# EAGLE design VSCard_v3 (EAGLE 8.3.1)
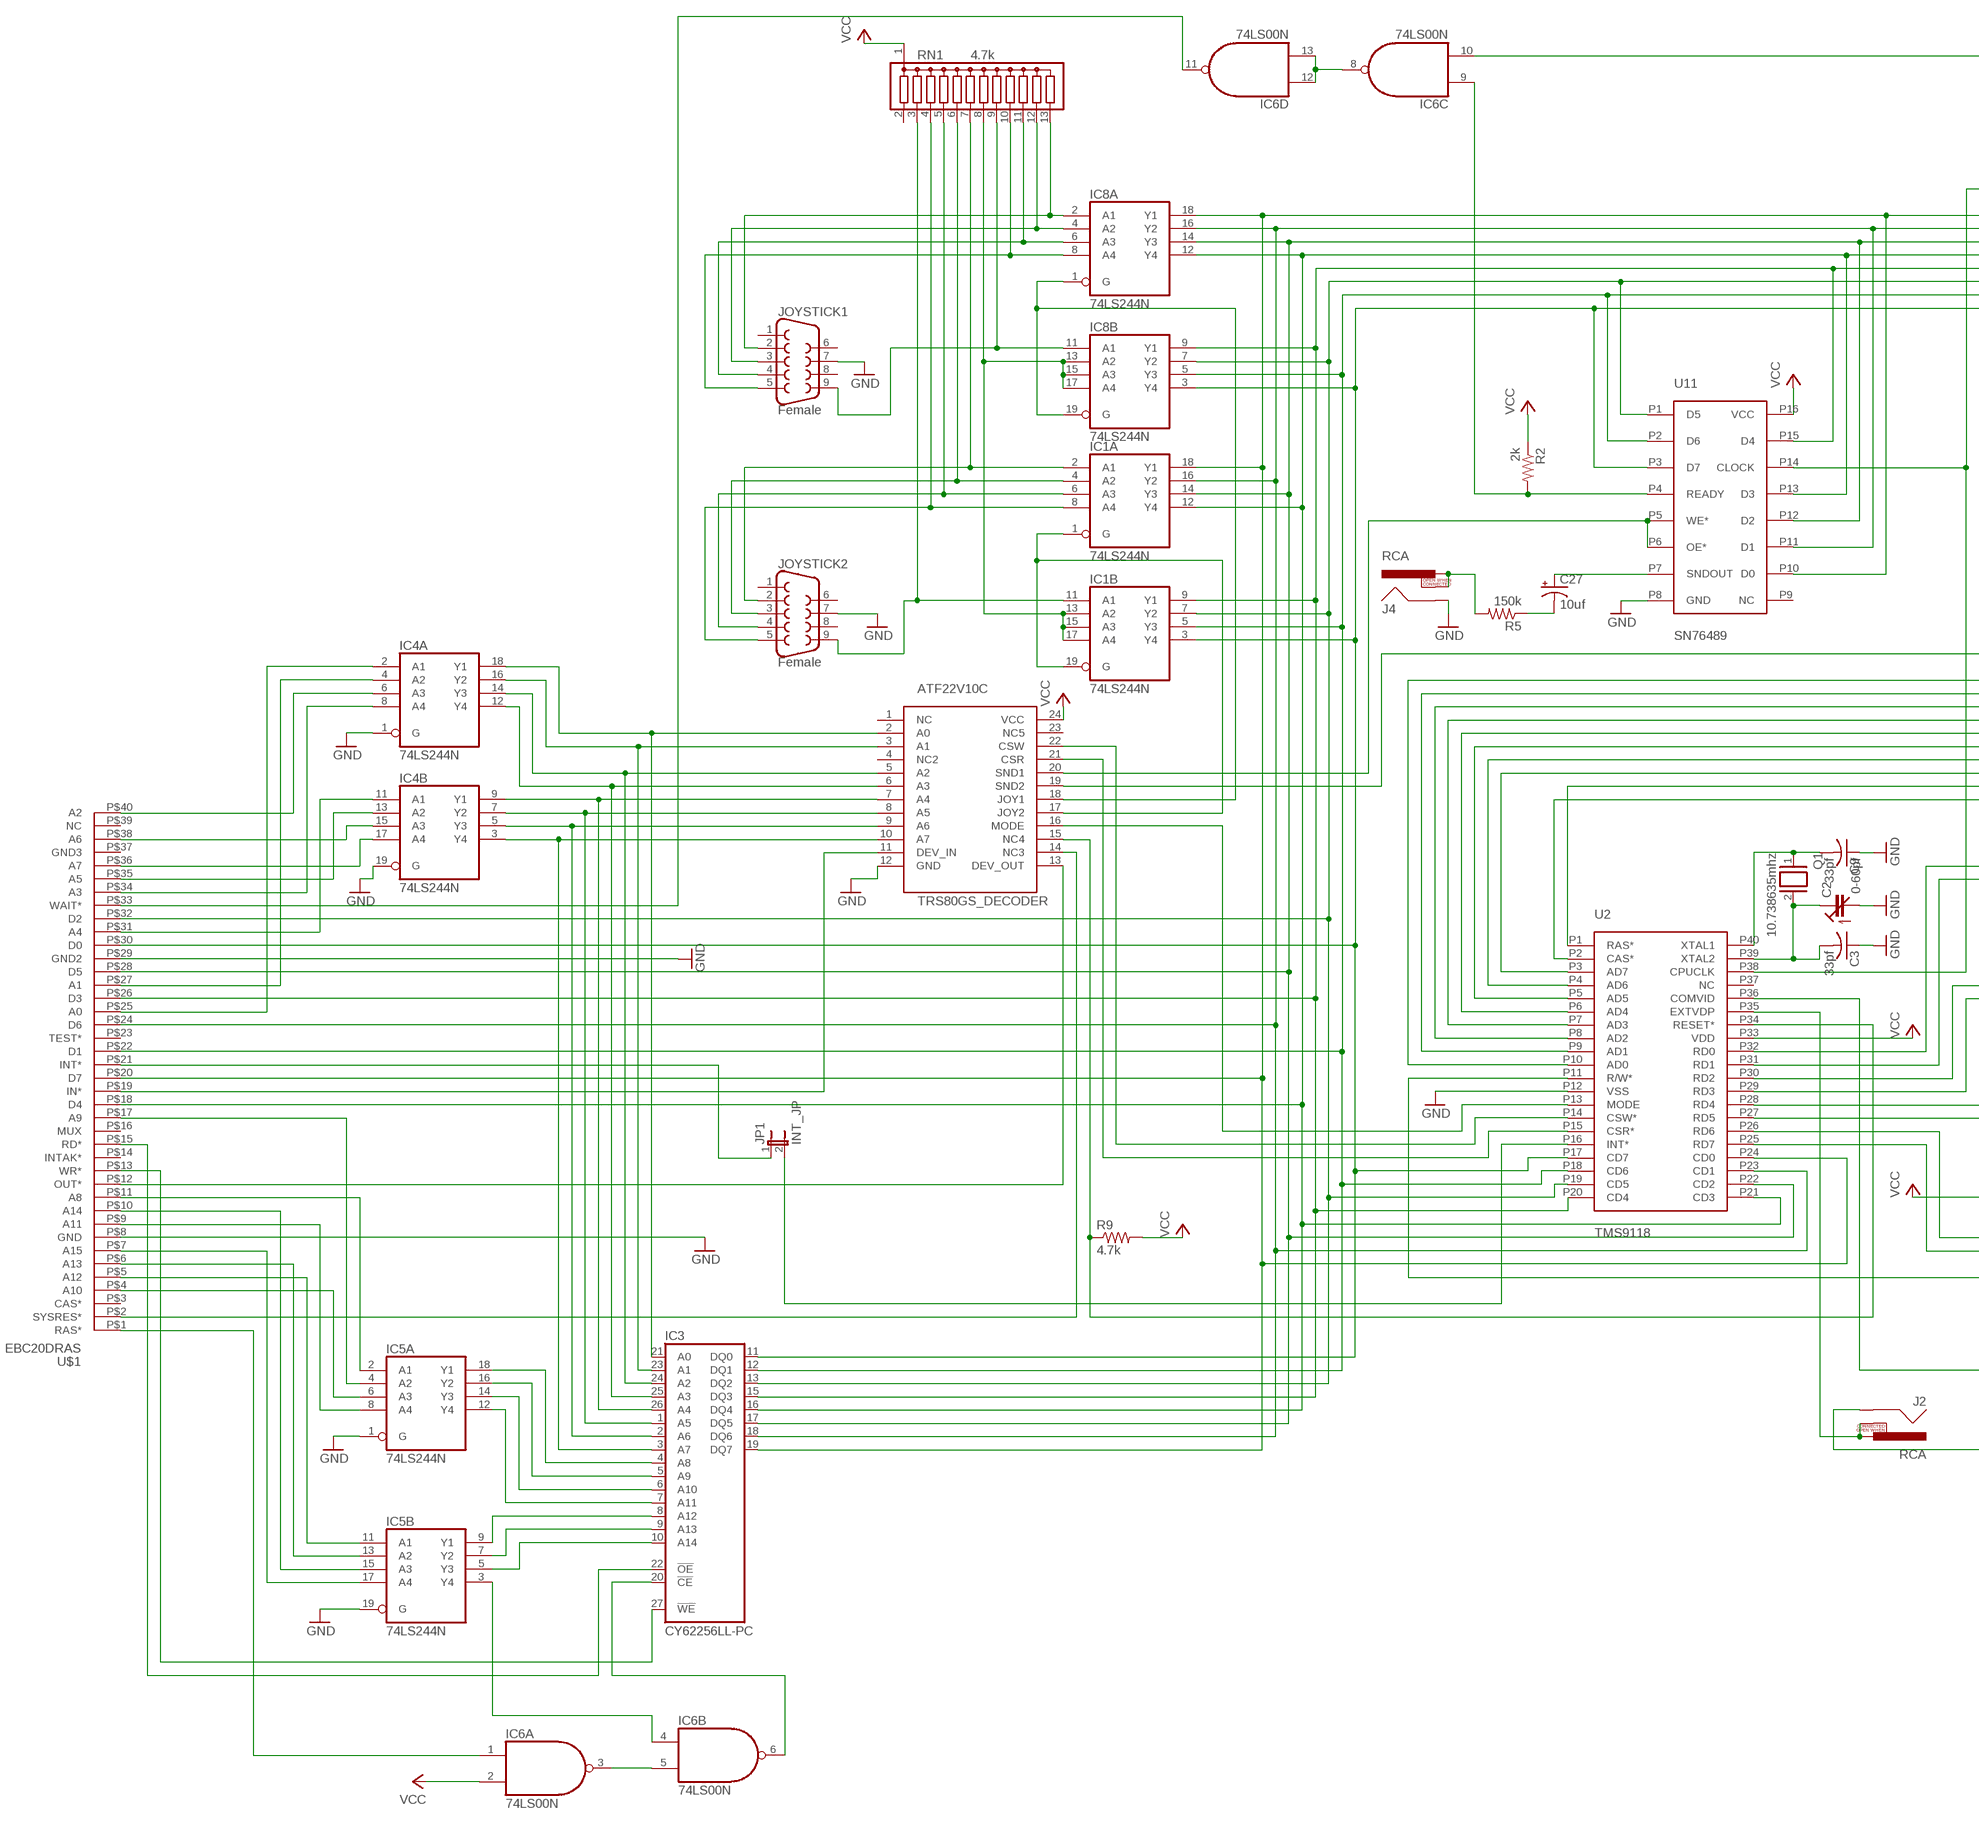
[diagram p0: schematic, sheet 1, part 1 of 2]
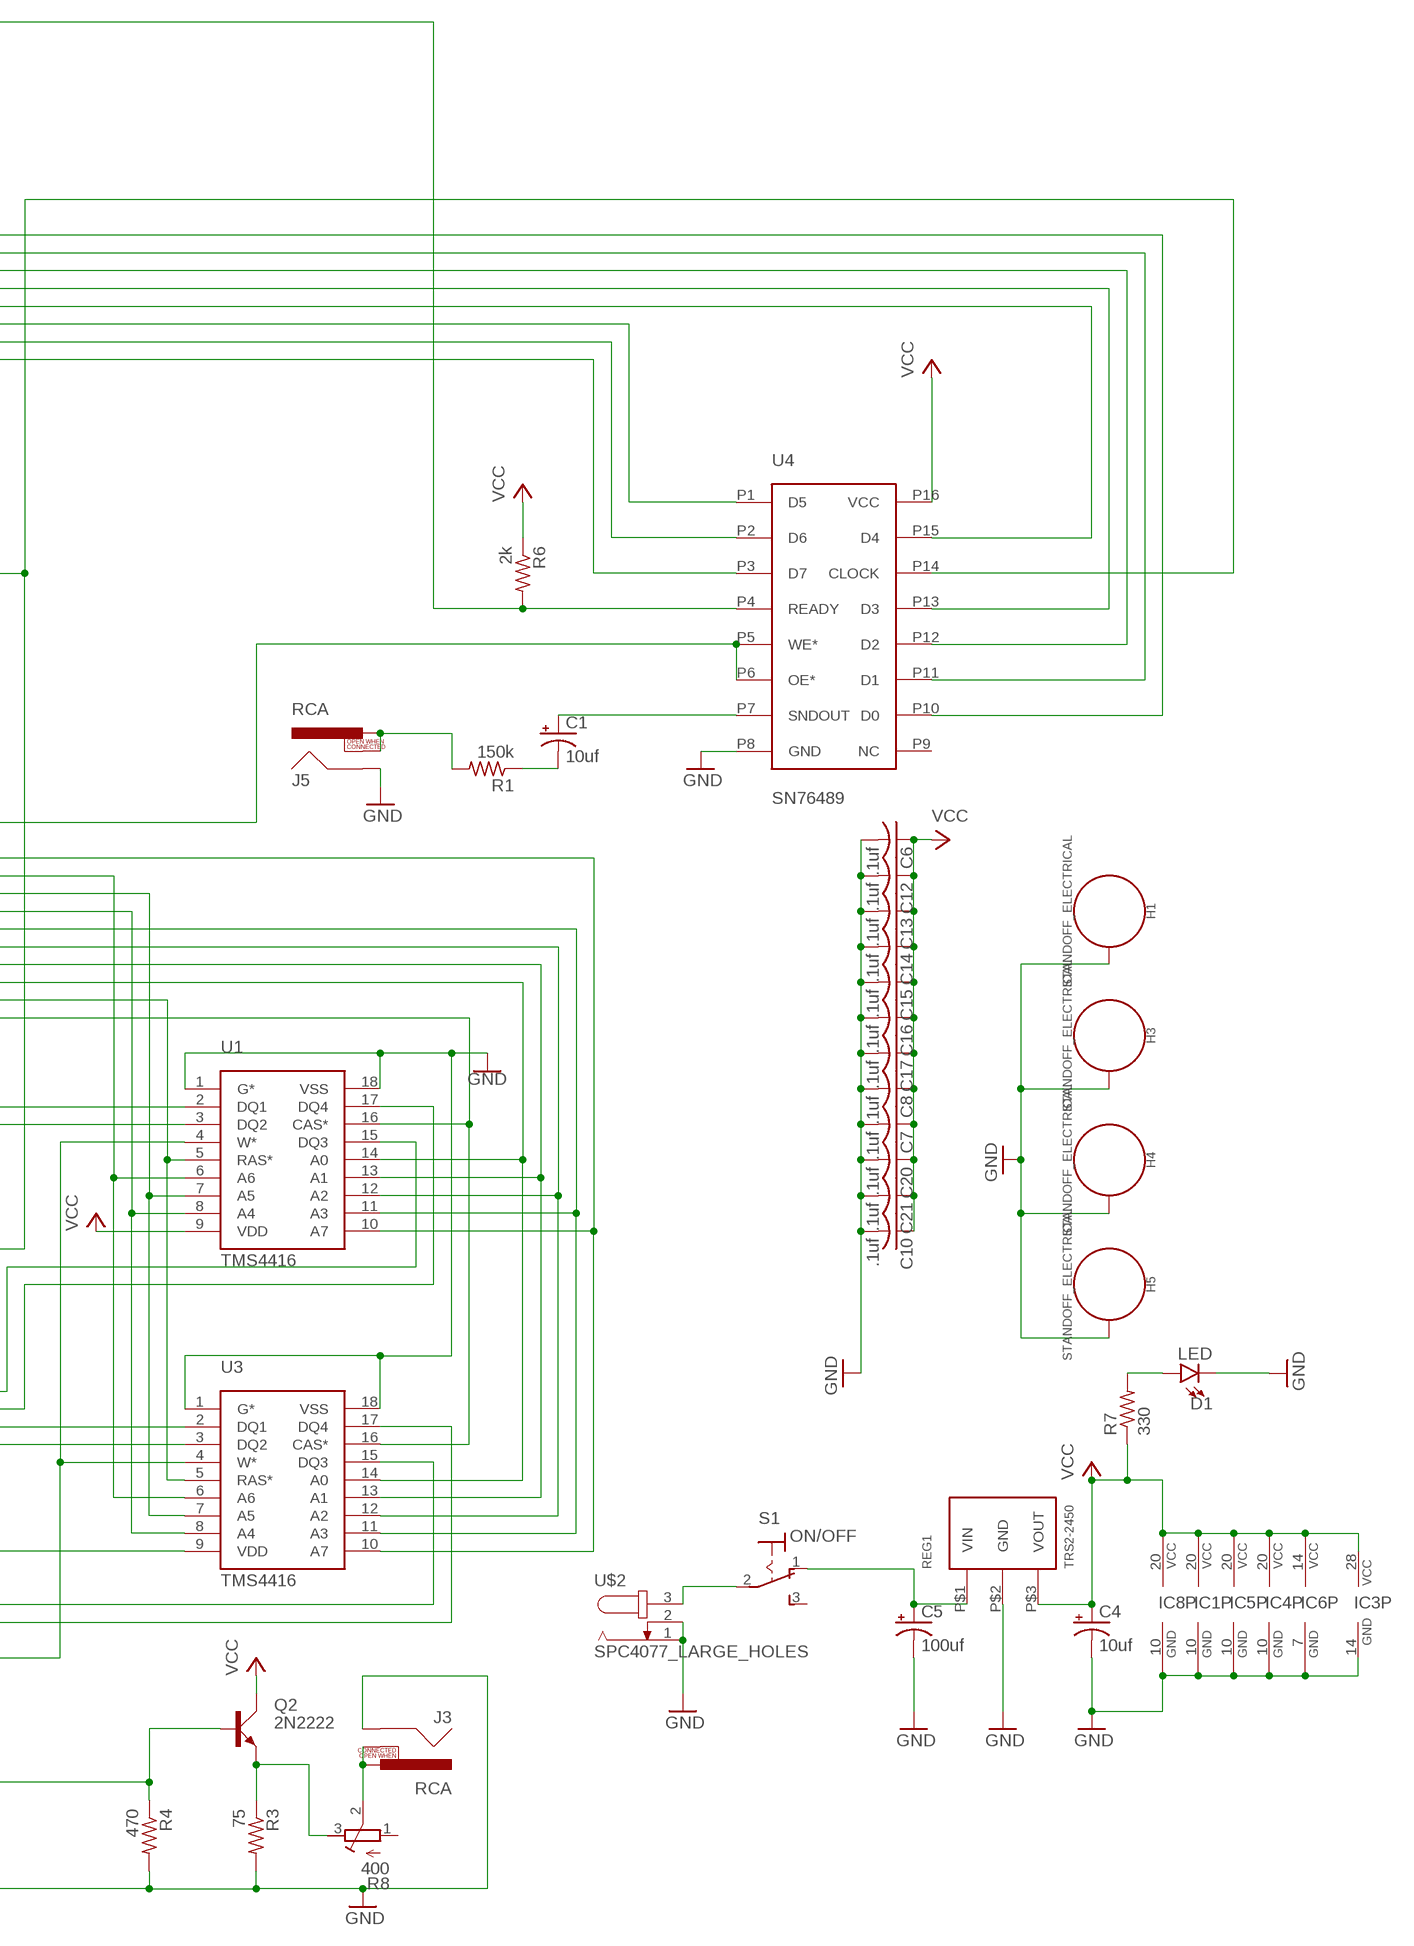
[diagram p1: schematic, sheet 1, part 2 of 2]

## Parts
ATF22V10C  TRS80GS_DECODER  [DIP24SKI]
C1  10uf  CPOL-USE2.5-6  [E2,5-6]
C2  0-60pf  C-TRIMM3050.504  [CTRIM3050.504]
C3  33pf  C-US050-050X075  [C050-050X075]
C4  10uf  CPOL-USE2.5-5  [E2,5-5]
C5  100uf  CPOL-USE3.5-10  [E3,5-10]
C6  .1uf  C-US025-025X050  [C025-025X050]
C7  .1uf  C-US025-025X050  [C025-025X050]
C8  .1uf  C-US025-025X050  [C025-025X050]
C9  33pf  C-US050-050X075  [C050-050X075]
C10  .1uf  C-US025-025X050  [C025-025X050]
C12  .1uf  C-US025-025X050  [C025-025X050]
C13  .1uf  C-US025-025X050  [C025-025X050]
C14  .1uf  C-US025-025X050  [C025-025X050]
C15  .1uf  C-US025-025X050  [C025-025X050]
C16  .1uf  C-US025-025X050  [C025-025X050]
C17  .1uf  C-US025-025X050  [C025-025X050]
C20  .1uf  C-US025-025X050  [C025-025X050]
C21  .1uf  C-US025-025X050  [C025-025X050]
C27  10uf  CPOL-USE2.5-6  [E2,5-6]
D1  LED  LED3MM  [LED_3MM]
H1  STANDOFF_ELECTRICAL  [STANDOFF-ELECTRICAL]
H3  STANDOFF_ELECTRICAL  [STANDOFF-ELECTRICAL]
H4  STANDOFF_ELECTRICAL  [STANDOFF-ELECTRICAL]
H5  STANDOFF_ELECTRICAL  [STANDOFF-ELECTRICAL]
IC1  74LS244N  [DIL20]
IC3  CY62256LL-PC  [DIL28-6]
IC4  74LS244N  [DIL20]
IC5  74LS244N  [DIL20]
IC6  74LS00N  [DIL14]
IC8  74LS244N  [DIL20]
J2  RCA  [RCA]
J3  RCA  [RCA]
J4  RCA  [RCA]
J5  RCA  [RCA]
JOYSTICK1  Female  DB9FEMALE  [DB9]
JOYSTICK2  Female  DB9FEMALE  [DB9]
JP1  INT_JP  JP1E  [JP1]
Q1  10.738635mhz  XTAL/S  [QS]
Q2  2N2222  [TO18A]
R1  150k  R-US_0207/2V  [0207/2V]
R2  2k  R-US_0207/2V  [0207/2V]
R3  75  R-US_0207/2V  [0207/2V]
R4  470  R-US_0207/2V  [0207/2V]
R5  150k  R-US_0207/2V  [0207/2V]
R6  2k  R-US_0207/2V  [0207/2V]
R7  330  R-US_0309/V  [0309V]
R8  400  R-TRIMM64W  [RTRIM64W]
R9  4.7k  R-US_0207/2V  [0207/2V]
REG1  TRS2-2450  [TRACON_REG]
RN1  4.7k  G12R  [SIL13]
S1  ON/OFF  320-916  [320-916]
U1  TMS4416  [DIP18]
U2  TMS9118  [DIP40_MCU]
U3  TMS4416  [DIP18]
U4  SN76489  [DIP16]
U11  SN76489  [DIP16]
U$1  EBC20DRAS  [EBC20DRAS]
U$2  SPC4077_LARGE_HOLES  [SPC4077]

## Nets
A0: IC4.2(A:A1) U$1.P$25(A0)
A1: IC4.4(A:A2) U$1.P$27(A1)
A2: IC4.6(A:A3) U$1.P$40(A2)
A3: IC4.8(A:A4) U$1.P$34(A3)
A4: IC4.11(B:A1) U$1.P$31(A4)
A5: IC4.13(B:A2) U$1.P$35(A5)
A6: IC4.15(B:A3) U$1.P$38(A6)
A7: ATF22V10C.10(A7) IC3.3(A7) IC4.3(B:Y4)
COMVID: Q2.B R4.1 U2.P36(COMVID)
COMVID-OUT: Q2.E R3.1 R8.3(E)
D0: IC1.3(B:Y4) IC3.11(DQ0) IC8.3(B:Y4) U2.P17(CD7) U4.P3(D7) U11.P3(D7) U$1.P$30(D0)
D1: IC1.5(B:Y3) IC3.12(DQ1) IC8.5(B:Y3) U2.P18(CD6) U4.P2(D6) U11.P2(D6) U$1.P$22(D1)
D2: IC1.7(B:Y2) IC3.13(DQ2) IC8.7(B:Y2) U2.P19(CD5) U4.P1(D5) U11.P1(D5) U$1.P$32(D2)
D3: IC1.9(B:Y1) IC3.15(DQ3) IC8.9(B:Y1) U2.P20(CD4) U4.P15(D4) U11.P15(D4) U$1.P$26(D3)
D4: IC1.12(A:Y4) IC3.16(DQ4) IC8.12(A:Y4) U2.P21(CD3) U4.P13(D3) U11.P13(D3) U$1.P$18(D4)
D5: IC1.14(A:Y3) IC3.17(DQ5) IC8.14(A:Y3) U2.P22(CD2) U4.P12(D2) U11.P12(D2) U$1.P$28(D5)
D6: IC1.16(A:Y2) IC3.18(DQ6) IC8.16(A:Y2) U2.P23(CD1) U4.P11(D1) U11.P11(D1) U$1.P$24(D6)
D7: IC1.18(A:Y1) IC3.19(DQ7) IC8.18(A:Y1) U2.P24(CD0) U4.P10(D0) U11.P10(D0) U$1.P$20(D7)
DOWN: IC8.4(A:A2) JOYSTICK1.3 RN1.12
DOWN1: IC1.4(A:A2) JOYSTICK2.3 RN1.6
GND: ATF22V10C.12(GND) C2.2(A) C3.1 C4.- C5.- C6.2 C7.2 C8.2 C9.1 C10.2 C12.2 C13.2 C14.2 C15.2 C16.2 C17.2 C20.2 C21.2 D1.K(C) H1.P1 H3.P1 H4.P1 H5.P1 IC1.10(P:GND) IC3.14(GND) IC4.1(A:G) IC4.10(P:GND) IC4.19(B:G) IC5.1(A:G) IC5.10(P:GND) IC5.19(B:G) IC6.7(P:GND) IC8.10(P:GND) J2.SHELL J3.SHELL J4.SHELL J5.SHELL JOYSTICK1.7 JOYSTICK2.7 R3.2 R4.2 REG1.P$2(GND) U1.1(G*) U1.18(VSS) U2.P12(VSS) U3.1(G*) U3.18(VSS) U4.P8(GND) U11.P8(GND) U$1.P$8(GND) U$1.P$29(GND2) U$2.1 U$2.2
IN*: ATF22V10C.11(DEV_IN) U$1.P$19(IN*)
INT*: JP1.1 U$1.P$21(INT*)
JOY1_IN_ENABLE_N: ATF22V10C.18(JOY1) IC8.1(A:G) IC8.19(B:G)
JOY1_IN_ENABLE_N1: ATF22V10C.17(JOY2) IC1.1(A:G) IC1.19(B:G)
LEFT: IC8.6(A:A3) JOYSTICK1.4 RN1.11
LEFT1: IC1.6(A:A3) JOYSTICK2.4 RN1.5
N$1: J4.PIN J4.SWITCH R5.2
N$2: S1.2(P) U$2.3
N$3: JP1.2 U2.P16(INT*)
N$4: J3.PIN J3.SWITCH R8.2(S)
N$5: ATF22V10C.2(A0) IC3.21(A0) IC4.18(A:Y1)
N$6: ATF22V10C.7(A4) IC3.26(A4) IC4.9(B:Y1)
N$7: ATF22V10C.3(A1) IC3.23(A1) IC4.16(A:Y2)
N$8: ATF22V10C.5(A2) IC3.24(A2) IC4.14(A:Y3)
N$9: ATF22V10C.6(A3) IC3.25(A3) IC4.12(A:Y4)
N$10: ATF22V10C.8(A5) IC3.1(A5) IC4.7(B:Y2)
N$12: ATF22V10C.9(A6) IC3.2(A6) IC4.5(B:Y3)
N$13: IC5.2(A:A1) U$1.P$11(A8)
N$14: ATF22V10C.22(CSW) U2.P14(CSW*)
N$15: ATF22V10C.21(CSR) U2.P15(CSR*)
N$16: C2.1(E) C3.2 Q1.2 U2.P39(XTAL2)
N$17: J2.PIN J2.SWITCH U2.P35(EXTVDP)
N$18: U1.5(RAS*) U2.P1(RAS*) U3.5(RAS*)
N$19: IC5.4(A:A2) U$1.P$17(A9)
N$20: D1.A R7.2
N$21: U1.16(CAS*) U2.P2(CAS*) U3.16(CAS*)
N$22: IC4.17(B:A4) U$1.P$36(A7)
N$23: IC5.6(A:A3) U$1.P$4(A10)
N$24: J5.PIN J5.SWITCH R1.2
N$25: IC5.8(A:A4) U$1.P$9(A11)
N$26: IC5.11(B:A1) U$1.P$5(A12)
N$27: IC5.13(B:A2) U$1.P$6(A13)
N$28: IC5.15(B:A3) U$1.P$10(A14)
N$29: IC5.17(B:A4) U$1.P$7(A15)
N$30: IC3.4(A8) IC5.18(A:Y1)
N$31: IC3.5(A9) IC5.16(A:Y2)
N$32: IC3.6(A10) IC5.14(A:Y3)
N$33: IC3.7(A11) IC5.12(A:Y4)
N$34: IC3.8(A12) IC5.9(B:Y1)
N$35: IC3.9(A13) IC5.7(B:Y2)
N$36: IC3.10(A14) IC5.5(B:Y3)
N$37: IC6.1(A:I0) U$1.P$1(RAS*)
N$38: IC5.3(B:Y4) IC6.4(B:I0)
N$39: IC6.3(A:O) IC6.5(B:I1)
N$40: IC3.20(!CE) IC6.6(B:O)
N$41: IC6.8(C:O) IC6.12(D:I0) IC6.13(D:I1)
N$42: IC3.27(!WE) U$1.P$13(WR*)
N$43: IC3.22(!OE) U$1.P$15(RD*)
N$64: C27.- R5.1
N$94: C1.- R1.1
N$99: IC1.13(B:A2) IC1.15(B:A3) IC1.17(B:A4) IC8.13(B:A2) IC8.15(B:A3) IC8.17(B:A4) RN1.8
OUT*: ATF22V10C.13(DEV_OUT) U$1.P$12(OUT*)
RIGHT: IC8.8(A:A4) JOYSTICK1.5 RN1.10
RIGHT1: IC1.8(A:A4) JOYSTICK2.5 RN1.4
SN76489-CLOCK: U2.P38(CPUCLK) U4.P14(CLOCK) U11.P14(CLOCK)
SND1_ENABLE_N: ATF22V10C.20(SND1) U11.P5(WE*) U11.P6(OE*)
SND1_READY: IC6.9(C:I0) R2.2 U11.P4(READY)
SND2_ENABLE_N: ATF22V10C.19(SND2) U4.P5(WE*) U4.P6(OE*)
SND2_READY: IC6.10(C:I1) R6.2 U4.P4(READY)
SNDOUT1: C27.+ U11.P7(SNDOUT)
SNDOUT2: C1.+ U4.P7(SNDOUT)
SYSRESET*: ATF22V10C.14(NC3) U$1.P$2(SYSRES*)
TMS9118_RW(*)_TMS4416_W(*): U1.4(W*) U2.P11(R/W*) U3.4(W*)
TMS9918_AD0-TMS4416_A7: U1.10(A7) U2.P10(AD0) U3.10(A7)
TMS9918_AD1-TMS4416_A6: U1.6(A6) U2.P9(AD1) U3.6(A6)
TMS9918_AD2-TMS4416_A5: U1.7(A5) U2.P8(AD2) U3.7(A5)
TMS9918_AD3-TMS4416_A4: U1.8(A4) U2.P7(AD3) U3.8(A4)
TMS9918_AD4-TMS4416_A3: U1.11(A3) U2.P6(AD4) U3.11(A3)
TMS9918_AD5-TMS4416_A2: U1.12(A2) U2.P5(AD5) U3.12(A2)
TMS9918_AD6-TMS4416_A1: U1.13(A1) U2.P4(AD6) U3.13(A1)
TMS9918_AD7-TMS4416_A0: U1.14(A0) U2.P3(AD7) U3.14(A0)
TRIGGER: IC8.11(B:A1) JOYSTICK1.9 RN1.9
TRIGGER1: IC1.11(B:A1) JOYSTICK2.9 RN1.3
UP: IC8.2(A:A1) JOYSTICK1.2 RN1.13
UP1: IC1.2(A:A1) JOYSTICK2.2 RN1.7
VCC: ATF22V10C.24(VCC) C4.+ C6.1 C7.1 C8.1 C10.1 C12.1 C13.1 C14.1 C15.1 C16.1 C17.1 C20.1 C21.1 IC1.20(P:VCC) IC3.28(VCC) IC4.20(P:VCC) IC5.20(P:VCC) IC6.2(A:I1) IC6.14(P:VCC) IC8.20(P:VCC) Q2.C R2.1 R6.1 R7.1 R9.2 REG1.P$3(VOUT) RN1.1 U1.9(VDD) U2.P33(VDD) U3.9(VDD) U4.P16(VCC) U11.P16(VCC)
VDP-RD0: U1.2(DQ1) U2.P32(RD0)
VDP-RD1: U1.3(DQ2) U2.P31(RD1)
VDP-RD2: U1.15(DQ3) U2.P30(RD2)
VDP-RD3: U1.17(DQ4) U2.P29(RD3)
VDP-RD4: U2.P28(RD4) U3.2(DQ1)
VDP-RD5: U2.P27(RD5) U3.3(DQ2)
VDP-RD6: U2.P26(RD6) U3.15(DQ3)
VDP-RD7: U2.P25(RD7) U3.17(DQ4)
VDP_MODE: ATF22V10C.16(MODE) U2.P13(MODE)
VID_RESET*: ATF22V10C.15(NC4) R9.1 U2.P34(RESET*)
VOLTAGE-IN: C5.+ REG1.P$1(VIN) S1.1(O)
WAIT*: IC6.11(D:O) U$1.P$33(WAIT*)
XTAL1: C9.2 Q1.1 U2.P40(XTAL1)
Unconnected: ATF22V10C.1(NC) ATF22V10C.4(NC2) ATF22V10C.23(NC5) JOYSTICK1.1 JOYSTICK1.6 JOYSTICK1.8 JOYSTICK2.1 JOYSTICK2.6 JOYSTICK2.8 R8.1(A) RN1.2 S1.3(S) U2.P37(NC) U4.P9(NC) U11.P9(NC) U$1.P$3(CAS*) U$1.P$14(INTAK*) U$1.P$16(MUX) U$1.P$23(TEST*) U$1.P$37(GND3) U$1.P$39(NC)

## Library data of the parts
ATF22V10C = TMS99:TRS80GS_DECODER
C1 C4 C27 = resistor:CPOL-US: POLARIZED CAPACITOR, American symbol
C2 = rcl:C-TRIMM: Trimm capacitor
C3 C9 = rcl:C-US: CAPACITOR, American symbol
C5 = rcl:CPOL-US: POLARIZED CAPACITOR, American symbol
C6-C8 C10 C12-C17 C20 C21 = resistor:C-US: CAPACITOR, American symbol
D1 = SparkFun-LED:LED: LED (Generic) Standard schematic elements and footprints for 5mm, 3mm, 1206, and 0603 sized LEDs. Generic LEDs with no color specified.; PROD_ID: DIO-08794
H1 H3-H5 = SparkFun-Hardware:STANDOFF_ELECTRICAL: Stand Off Drill holes with an electrical connection. For example, use these to ground your board to a chassis. Example SparkFun Products Screw - Phillips Head (1/4", 4-40, 10 pack) <https://www.sparkfun.com/products/10453> (PRT-10453) Screw - Phillips Head (1/2", 4-40, 10 pack) <https://www.sparkfun.com/products/10452> (PRT-10452) Screw - Phillips Head (3/4", 4-40, 10 pack) <https://www.sparkfun.com/products/10451> (PRT-10451) Screw - Phillips Head (1", 4-40, 10 pack) <https://www.sparkfun.com/products/10450> (PRT-10450)
IC1 IC4 IC5 IC8 = 74xx-us:74*244: Octal BUFFER and LINE DRIVER, 3-state
IC3 = memory-sram:CY62256LL-?*: 256K (32K x 8) CMOS-Static RAM Source: http://download.cypress.com.edgesuite.net/design_resources/datasheets/contents/cy62256_8.pdf
IC6 = 74xx-us:74*00: Quad 2-input NAND gate
J2-J5 = SparkFun-Connectors:RCA: RCA Jack connector This is a right angle RCA jack connecotr. Commonly used for video or audio. Here is the connector we sell at SparkFun: RCA Jack <https://www.sparkfun.com/products/8631> (PRT-08631) Datasheet <http://www.sparkfun.com/datasheets/Prototyping/Connectors/RCA-Jack.pdf> It is not used on any active designs, however it was used on a couple retired products: RCA Jack Breakout [RETIRED] <https://www.sparkfun.com/products/8826> (PRT-08826) SparkFun On Screen Display Breakout - MAX7456 [RETIRED] <https://www.sparkfun.com/products/9168> (BOB-09168) You may also be interested in a cable: RCA Video Cable - 6' <https://www.sparkfun.com/products/11573> (CAB-11573); PROD_ID: CONN-09081; SF_ID: PRT-08631
JOYSTICK1 JOYSTICK2 = SparkFun-Connectors:DB9: DB9 Connector Standard DB9 (D-Sub 9) serial connector. Can be used for CAN bus as well as RS485 and RS232. Footprint production proven. Here is the female version connector we sell at SparkFun: 9 Pin Female Serial Connector - PCB Mount <https://www.sparkfun.com/products/429> (PRT-00429) This connector has been used on the following SparkFun products: SparkFun RS232 Shifter - SMD <https://www.sparkfun.com/products/449> (PRT-00449) SparkFun RS232 Shifter SMD (No DB9) <https://www.sparkfun.com/products/8780> (PRT-08780); PROD_ID: CONN-08194
JP1 = jumper:JP1E: JUMPER
Q1 = special:XTAL/S: CRYSTAL
Q2 = transistor-small-signal:2N2222: NPN TRANSISTOR
R1-R7 R9 = resistor:R-US_: RESISTOR, American symbol
R8 = resistor:R-TRIMM: Trimm resistor
REG1 = TMS99:TRS2-2450: 5V TRACO regulator
RN1 = resistor-sil:G12R: SIL RESISTOR; OC_FARNELL: unknown; OC_NEWARK: unknown
S1 = switch:320-916: TOGGLE SWITCH distributor RS Components
U1 U3 = TMS99:TMS4416: TMS4416
U2 = TMS99:TMS9118: TMS9118
U4 U11 = TMS99:SN76489: SN76489 Sound Chip
U$1 = TMS99:EBC20DRAS
U$2 = con-jack:SPC4077_LARGE_HOLES

## Board
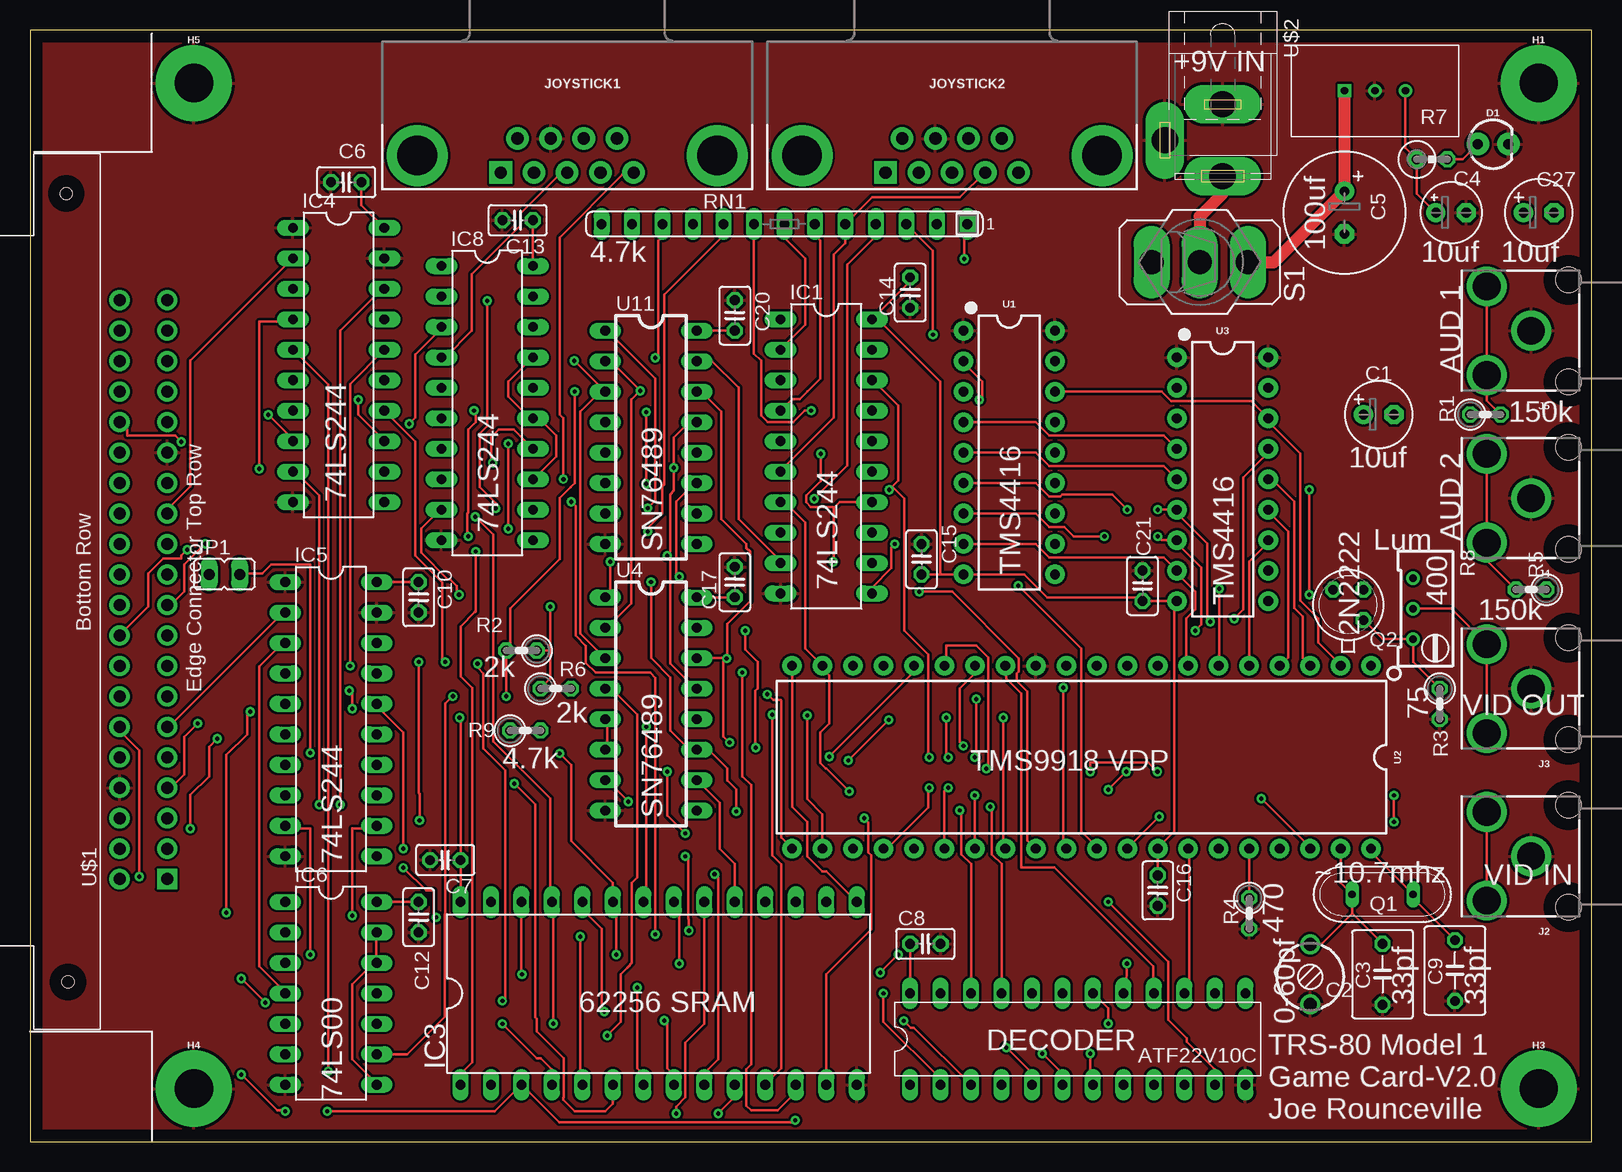
[diagram p2: board, top side]
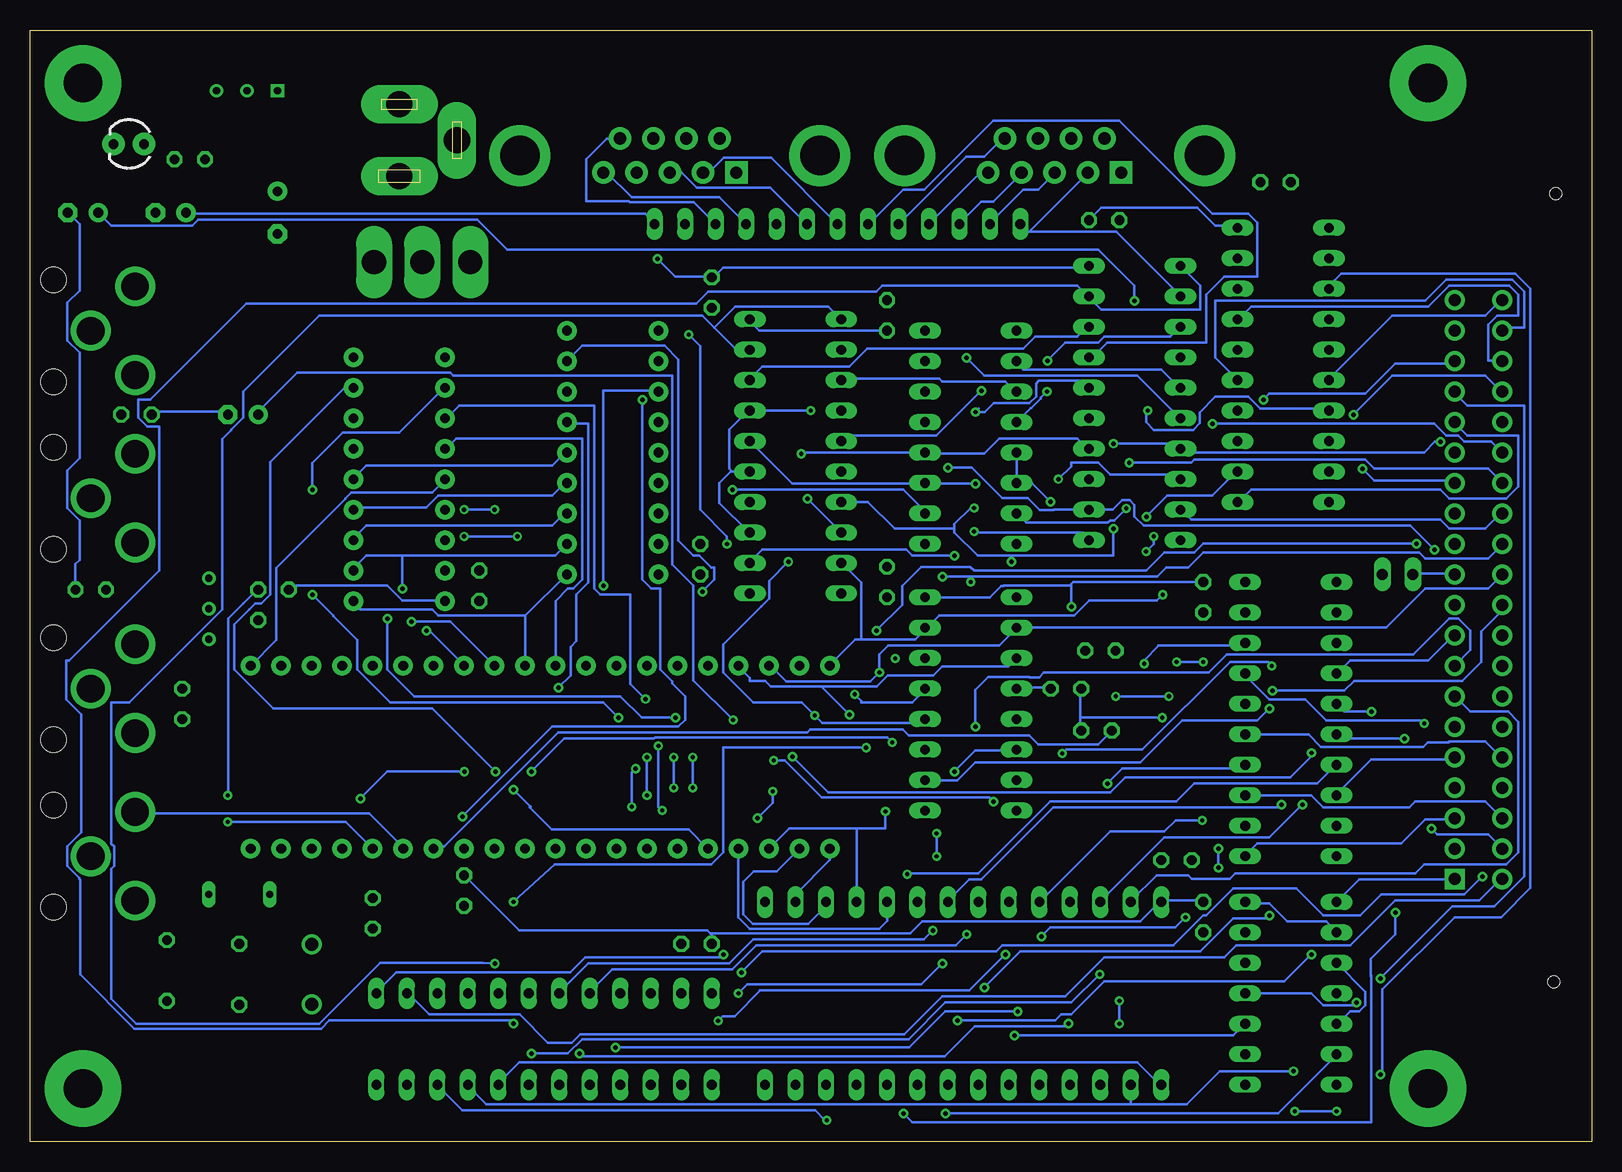
[diagram p3: board, bottom side, seen from below]

Size 130.16 x 92.7 mm. Coordinates in mm from the lower left corner, seen from the top.
Outline: 0,0 130.16,0 130.16,92.7 0,92.7 0,0
Copper layers (1*16): Top 0.035mm / dielectric 1.5mm / Bottom 0.035mm
Design rules "default": minimum track width 0.2mm, minimum drill 0.35mm, track to track 8mil, track to pad 8mil, pad to pad 8mil, via to via 8mil, smd to smd 8mil, copper to edge 40mil, drill to drill 6mil, minimum pad ring 10mil, minimum via ring 8mil, stop-mask expansion 4mil, vias tented up to drill 0mil, thermal gap 10mil

### Footprints (pad centres in the part's own frame; a part is rotated, then mirrored left to right if it is on the bottom)
DIP24SKI = drill 0.813 pad 1.27 long: 1 -11.43,-3.81; 2 -8.89,-3.81; 3 -6.35,-3.81; 4 -3.81,-3.81; 5 -1.27,-3.81; 6 1.27,-3.81; 7 3.81,-3.81; 8 6.35,-3.81; 9 8.89,-3.81; 10 11.43,-3.81; 11 13.97,-3.81; 12 16.51,-3.81; 13 16.51,3.81; 14 13.97,3.81; 15 11.43,3.81; 16 8.89,3.81; 17 6.35,3.81; 18 3.81,3.81; 19 1.27,3.81; 20 -1.27,3.81; 21 -3.81,3.81; 22 -6.35,3.81; 23 -8.89,3.81; 24 -11.43,3.81
E2,5-6 = drill 0.813 pad 1.6: + -1.27,0 | drill 0.813 pad 1.6 octagon: - 1.27,0
CTRIM3050.504 = drill 1.1: 1 -2.5,0; 2 2.5,0
C050-050X075 = drill 0.813 octagon: 1 -2.54,0; 2 2.54,0
E2,5-5 = drill 0.813 pad 1.6: + -1.27,0 | drill 0.813 pad 1.6 octagon: - 1.27,0
E3,5-10 = drill 0.813 pad 1.6: + -1.778,0 | drill 0.813 pad 1.6 octagon: - 1.778,0
C025-025X050 = drill 0.813 octagon: 1 -1.27,0; 2 1.27,0
LED_3MM = drill 0.813 pad 1.88: A -1.27,0; K 1.27,0
STANDOFF-ELECTRICAL = drill 3.2 pad 6.35: P1 0,0
DIL20 = drill 0.813 long: 1 -11.43,-3.81; 2 -8.89,-3.81; 3 -6.35,-3.81; 4 -3.81,-3.81; 5 -1.27,-3.81; 6 1.27,-3.81; 7 3.81,-3.81; 8 6.35,-3.81; 9 8.89,-3.81; 10 11.43,-3.81; 11 11.43,3.81; 12 8.89,3.81; 13 6.35,3.81; 14 3.81,3.81; 15 1.27,3.81; 16 -1.27,3.81; 17 -3.81,3.81; 18 -6.35,3.81; 19 -8.89,3.81; 20 -11.43,3.81
DIL28-6 = drill 0.813 long: 1 -16.51,-7.62; 2 -13.97,-7.62; 3 -11.43,-7.62; 4 -8.89,-7.62; 5 -6.35,-7.62; 6 -3.81,-7.62; 7 -1.27,-7.62; 8 1.27,-7.62; 9 3.81,-7.62; 10 6.35,-7.62; 11 8.89,-7.62; 12 11.43,-7.62; 13 13.97,-7.62; 14 16.51,-7.62; 15 16.51,7.62; 16 13.97,7.62; 17 11.43,7.62; 18 8.89,7.62; 19 6.35,7.62; 20 3.81,7.62; 21 1.27,7.62; 22 -1.27,7.62; 23 -3.81,7.62; 24 -6.35,7.62; 25 -8.89,7.62; 26 -11.43,7.62; 27 -13.97,7.62; 28 -16.51,7.62
DIL14 = drill 0.813 long: 1 -7.62,-3.81; 2 -5.08,-3.81; 3 -2.54,-3.81; 4 0,-3.81; 5 2.54,-3.81; 6 5.08,-3.81; 7 7.62,-3.81; 8 7.62,3.81; 9 5.08,3.81; 10 2.54,3.81; 11 0,3.81; 12 -2.54,3.81; 13 -5.08,3.81; 14 -7.62,3.81
RCA = drill 2.3: PIN 3.7,3.7; SHELL 0,0; SWITCH 3.7,-3.7 | hole 2.1: -3.1,4.25; -3.1,-4.25
DB9 = drill 1.016 pad 1.88 square: 1 -5.54,-1.42 | drill 1.016 pad 1.88: 2 -2.77,-1.42; 3 0,-1.42; 4 2.77,-1.42; 5 5.54,-1.42; 6 -4.15,1.42; 7 -1.38,1.42; 8 1.38,1.42; 9 4.15,1.42 | drill 3.302 pad 5.08: G1 -12.5,0; G2 12.5,0
JP1 = drill 0.914 long: 1 0,-1.27; 2 0,1.27
QS = drill 0.61 long: 1 -2.54,0; 2 2.54,0
TO18A = drill 0.813 octagon: B 1.27,-1.27; C 1.27,1.27; E -1.27,-1.27
0207/2V = drill 0.813 octagon: 1 -1.27,0; 2 1.27,0
0309V = drill 0.813 octagon: 1 -1.27,0; 2 1.27,0
RTRIM64W = drill 0.61: 1 1.27,-2.54; 2 1.27,0; 3 1.27,2.54
TRACON_REG = drill 0.6 square: P$1 0,0 | drill 0.6: P$2 2.54,0; P$3 5.08,0
SIL13 = drill 0.813 long: 1 -15.24,0; 2 -12.7,0; 3 -10.16,0; 4 -7.62,0; 5 -5.08,0; 6 -2.54,0; 7 0,0; 8 2.54,0; 9 5.08,0; 10 7.62,0; 11 10.16,0; 12 12.7,0; 13 15.24,0
320-916 = drill 2.007 long: 1 0,4.013; 2 0,0; 3 0,-4.013
DIP18 = drill 0.813 pad 1.626: 1 -10.16,-3.81; 2 -7.62,-3.81; 3 -5.08,-3.81; 4 -2.54,-3.81; 5 0,-3.81; 6 2.54,-3.81; 7 5.08,-3.81; 8 7.62,-3.81; 9 10.16,-3.81; 10 10.16,3.81; 11 7.62,3.81; 12 5.08,3.81; 13 2.54,3.81; 14 0,3.81; 15 -2.54,3.81; 16 -5.08,3.81; 17 -7.62,3.81; 18 -10.16,3.81
DIP40_MCU = drill 0.813 pad 1.626: P1 -24.13,-7.62; P2 -21.59,-7.62; P3 -19.05,-7.62; P4 -16.51,-7.62; P5 -13.97,-7.62; P6 -11.43,-7.62; P7 -8.89,-7.62; P8 -6.35,-7.62; P9 -3.81,-7.62; P10 -1.27,-7.62; P11 1.27,-7.62; P12 3.81,-7.62; P13 6.35,-7.62; P14 8.89,-7.62; P15 11.43,-7.62; P16 13.97,-7.62; P17 16.51,-7.62; P18 19.05,-7.62; P19 21.59,-7.62; P20 24.13,-7.62; P21 24.13,7.62; P22 21.59,7.62; P23 19.05,7.62; P24 16.51,7.62; P25 13.97,7.62; P26 11.43,7.62; P27 8.89,7.62; P28 6.35,7.62; P29 3.81,7.62; P30 1.27,7.62; P31 -1.27,7.62; P32 -3.81,7.62; P33 -6.35,7.62; P34 -8.89,7.62; P35 -11.43,7.62; P36 -13.97,7.62; P37 -16.51,7.62; P38 -19.05,7.62; P39 -21.59,7.62; P40 -24.13,7.62
DIP16 = drill 0.813 long: P1 -8.89,-3.81; P2 -6.35,-3.81; P3 -3.81,-3.81; P4 -1.27,-3.81; P5 1.27,-3.81; P6 3.81,-3.81; P7 6.35,-3.81; P8 8.89,-3.81; P9 8.89,3.81; P10 6.35,3.81; P11 3.81,3.81; P12 1.27,3.81; P13 -1.27,3.81; P14 -3.81,3.81; P15 -6.35,3.81; P16 -8.89,3.81
EBC20DRAS = drill 1 pad 1.676 square: P$1 0,0 | drill 1 pad 1.676: P$2 0,3.969; P$3 2.54,0; P$4 2.54,3.969; P$5 5.08,0; P$6 5.08,3.969; P$7 7.62,0; P$8 7.62,3.969; P$9 10.16,0; P$10 10.16,3.969; P$11 12.7,0; P$12 12.7,3.969; P$13 15.24,0; P$14 15.24,3.969; P$15 17.78,0; P$16 17.78,3.969; P$17 20.32,0; P$18 20.32,3.969; P$19 22.86,0; P$20 22.86,3.969; P$21 25.4,0; P$22 25.4,3.969; P$23 27.94,0; P$24 27.94,3.969; P$25 30.48,0; P$26 30.48,3.969; P$27 33.02,0; P$28 33.02,3.969; P$29 35.56,0; P$30 35.56,3.969; P$31 38.1,0; P$32 38.1,3.969; P$33 40.64,0; P$34 40.64,3.969; P$35 43.18,0; P$36 43.18,3.969; P$37 45.72,0; P$38 45.72,3.969; P$39 48.26,0; P$40 48.26,3.969 | hole 1: -8.572,8.255; 57.15,8.414
SPC4077 = drill 2.184 pad 2.184 long: 1 -3,0; 2 0,-4.8; 3 3,0

### Placement (x,y rotation side)
ATF22V10C  84.77,8.57 0 top
C1  112.39,60.64 0 top
C2  106.68,13.97 270 top
C3  112.71,13.97 90 top
C4  118.43,77.47 0 top
C5  109.54,77.47 270 top
C6  26.35,80.01 180 top
C7  34.61,23.49 180 top
C8  74.61,16.51 0 top
C9  118.74,14.29 90 top
C10  32.39,45.4 270 top
C12  32.39,18.73 270 top
C13  40.64,76.83 180 top
C14  73.34,70.8 270 top
C15  74.3,48.58 90 top
C16  93.98,20.95 270 top
C17  58.74,46.67 90 top
C20  58.74,68.9 90 top
C21  92.71,46.36 90 top
C27  125.73,77.47 0 top
D1  121.92,83.18 0 top
H1  125.73,88.27 0 top
H3  125.73,4.45 0 top
H4  13.65,4.45 0 top
H5  13.65,88.27 0 top
IC1  66.36,57.15 270 top
IC3  52.39,12.38 0 top
IC4  25.72,64.77 270 top
IC5  25.08,35.24 270 top
IC6  25.08,12.38 270 top
IC8  38.1,61.59 270 top
J2  125.09,23.81 180 top
J3  125.09,37.78 180 top
J4  125.09,53.66 180 top
J5  125.09,67.63 180 top
JOYSTICK1  44.77,82.23 0 top
JOYSTICK2  76.83,82.23 0 top
JP1  16.19,47.31 270 top
Q1  112.71,20.64 180 top
Q2  109.85,44.77 90 top
R1  121.28,60.64 0 top
R2  40.96,40.96 180 top
R3  117.47,36.51 270 top
R4  101.6,19.05 270 top
R5  125.09,46.04 180 top
R6  43.82,37.78 0 top
R7  116.84,81.91 0 top
R8  116.52,44.45 180 top
R9  41.27,34.29 0 top
REG1  109.54,87.63 0 top
RN1  62.87,76.52 180 top
S1  97.47,73.34 270 top
U1  81.6,57.47 270 top
U2  87.63,32.07 180 top
U3  99.38,55.25 270 top
U4  51.75,36.51 270 top
U11  51.75,58.74 270 top
U$1  11.43,21.91 90 top
U$2  99.38,83.5 270 top

### Tracks (layer width: path | path; a pad name or v marks a point on that pad's centre or on a via)
A0
  Top 0.2: IC4.2 21.86,73.61 13.37,65.11 13.37,54.62 11.62,52.87 11.62,52.62 U$1.P$25
A1  (via drill 0.35)
  Top 0.2: v19.11,56.12 19.11,68.36 21.86,68.36 IC4.4
  Bottom 0.2: v19.11,56.12 18.11,55.12 11.62,55.12 U$1.P$27
A2
  Bottom 0.2: IC4.6 21.86,63.62 16.61,68.86 8.87,68.86 7.62,70.11 U$1.P$40
A3  (via drill 0.35)
  Top 0.2: v19.86,60.62 21.86,58.62 IC4.8
  Bottom 0.2: v19.86,60.62 16.61,63.87 8.87,63.87 7.62,62.62 U$1.P$34
A4
  Bottom 0.2: IC4.11 29.36,53.37 28.36,54.37 12.62,54.37 11.87,53.62 7.12,53.62 6.12,54.62 6.12,58.87 10.37,58.87 11.37,59.87 U$1.P$31
A5  (via drill 0.35)
  Top 0.2: v27.36,61.87 27.36,60.62 29.36,58.62 IC4.13
  Bottom 0.2: v27.36,61.87 26.86,62.37 18.86,62.37 16.36,64.86 11.62,64.86 U$1.P$35
A6
  Bottom 0.2: IC4.15 29.61,63.62 31.36,65.36 31.36,70.11 13.87,70.11 12.12,71.86 6.62,71.86 5.62,70.86 5.62,67.86 7.37,67.86 U$1.P$38
A7  (via drill 0.35)
  Top 0.2: v17.61,5.62 20.61,2.62 21.2,2.62 v21.27,2.54 | v63.76,1.8 63.58,1.61 44.12,1.61 41.12,4.62 IC3.3 38.73,2.54 v24.76,2.54
  Bottom 0.2: ATF22V10C.10 96.11,4.62 94.11,2.62 64.72,2.62 63.91,1.8 v63.76,1.8 | IC4.3 21.86,71.36 20.86,72.36 6.37,72.36 5.12,71.11 5.12,21.17 7.55,18.73 11.43,18.73 17.46,12.7 17.46,5.77 v17.61,5.62 | v21.27,2.54 v24.76,2.54
COMVID  (via drill 0.35)
  Top 0.2: U2.P36 R4.1 | v113.66,28.89 v113.66,26.67
  Bottom 0.2: Q2.B 111.36,45.87 112.36,44.87 112.39,44.87 113.61,43.64 113.61,28.94 v113.66,28.89 | v113.66,26.67 103.82,26.67 U2.P36
COMVID-OUT
  Top 0.2: R3.1 115.25,40.01 R8.3 112.71,41.91 Q2.E
D0  (via drill 0.35)
  Top 0.2: v61.87,35.62 61.87,23.86 62.62,23.11 62.62,6.12 61.37,4.87 IC3.11 | 47.62,62.87 47.87,62.62 U11.P3 47.62,62.87 | 47.62,62.87 v45.37,65.11 | v31.61,59.87 32.12,60.37 32.12,65.61 34.12,67.61 34.12,67.86 IC8.3 | 47.62,62.87 47.62,62.62 45.87,60.87 45.87,42.37 47.87,40.37 U4.P3
  Bottom 0.2: U4.P3 48.12,40.12 48.62,39.62 54.12,39.62 54.87,38.87 58.67,38.87 59.58,37.96 64.21,37.96 | U2.P17 71.11,39.62 70.17,38.67 70.17,38.42 68.89,38.42 68.43,37.96 64.21,37.96 | U11.P3 48.12,62.62 48.87,63.37 54.12,63.37 54.37,63.62 62.37,63.62 IC1.3 | v45.37,65.11 43.87,66.61 41.12,66.61 40.62,67.11 35.12,67.11 34.37,67.86 IC8.3 | v31.61,59.87 13.12,59.87 12.12,58.87 11.12,58.87 10.62,58.37 8.37,58.37 7.62,57.62 U$1.P$30 | v61.87,35.62 64.21,37.96
D1  (via drill 0.35)
  Top 0.2: U11.P2 48.12,64.86 48.62,64.86 v50.87,62.62 50.12,61.87 50.12,44.87 48.12,42.87 U4.P2 | IC3.12 63.82,4.13 62.3,2.62 60.12,2.62 59.7,3.03 59.7,5.82 59.69,5.83 59.69,6.03 60.11,6.45 60.11,29.74 59.37,30.48 59.37,37.86 v59.37,39.14
  Bottom 0.2: IC8.5 34.37,62.87 35.87,64.36 47.37,64.36 47.87,64.86 U11.P2 | v50.87,62.62 54.62,58.87 62.12,58.87 62.37,58.62 IC1.5 | U2.P18 68.36,39.62 67.11,38.37 60.14,38.37 v59.37,39.14 59.37,40.64 58.65,41.37 49.37,41.37 48.12,42.62 U4.P2 47.87,42.87 17.11,42.87 13.87,46.12 8.62,46.12 7.62,47.12 U$1.P$22
D2  (via drill 0.35)
  Top 0.2: IC3.13 66.36,4.87 66.36,13.97 70.11,17.73 70.11,23.86 69.86,24.11 69.86,26.65 v69.53,26.99 | v12.62,58.37 12.12,58.87 8.12,58.87 8.12,59.37 7.62,59.87 U$1.P$32 | v48.37,48.37 48.37,45.87 48.12,45.62 U4.P1 | U11.P1 48.12,67.61 52.12,63.62 52.12,53.48 v51.48,52.84 | v39.87,51.12 v39.87,58.2 | IC1.7 62.62,53.12 63.12,53.12 64.61,51.62 64.61,41.12 65.86,39.87 U2.P19 66.11,39.62 66.11,39.37 66.61,38.87 66.61,34.87 65.86,34.12 65.86,31.58 66.33,31.12 66.36,31.12 v68.26,29.21
  Bottom 0.2: v39.87,51.12 39.87,48.87 48.37,48.87 | 48.37,48.87 51.19,48.87 53.11,50.79 53.11,51.08 | v51.48,52.84 51.76,52.84 53.11,51.49 53.11,51.36 | 53.11,51.08 53.11,51.36 | 53.12,51.37 53.11,51.36 | v48.37,48.37 48.37,48.87 | 48.37,48.87 | IC1.7 60.33,53.34 58.1,51.12 53.15,51.12 53.11,51.08 | v68.26,29.21 68.26,28.26 v69.53,26.99 | v12.62,58.37 13.07,58.37 13.97,57.47 20.84,57.47 20.85,57.46 33.96,57.46 IC8.7 34.71,58.2 v39.87,58.2
D3  (via drill 0.35)
  Top 0.2: 55.62,64.86 U11.P15 56.83,65.09 59.05,62.87 59.05,51.93 62.37,48.62 62.37,48.37 IC1.9 | 34.87,46.87 34.83,46.9 | 34.83,46.9 32.62,49.12 32.62,51.12 34.12,52.62 IC8.9 | 34.83,46.9 35.02,46.9 35.56,46.36 35.56,45.8 v35.75,45.62 | U2.P20 63.5,27.94 64.77,26.67 64.77,23.81 66.04,22.54 66.36,22.54 IC3.15
  Bottom 0.2: IC8.9 34.12,52.62 33.37,51.87 12.62,51.87 11.87,51.12 8.87,51.12 7.62,52.37 U$1.P$26 | 60.87,41.87 61.37,41.87 63.37,39.87 U2.P20 | 60.87,41.87 56.37,41.87 55.62,42.62 U4.P15 55.37,42.87 54.37,43.87 43.12,43.87 41.87,45.12 36.25,45.12 v35.75,45.62 | 60.87,41.87 60.87,46.62 62.37,48.12 IC1.9
D4  (via drill 0.35)
  Top 0.2: U4.P13 55.37,37.87 53.37,39.87 53.37,48.87 v53.12,48.87 53.12,48.99 53.34,49.21 53.34,53.98 53.66,54.29 v53.66,56.2 53.66,58.74 54.93,60.01 U11.P13 | v13.12,49.37 12.62,48.87 12.62,48.62 11.12,48.62 9.87,47.37 9.87,44.62 7.62,42.37 U$1.P$18 | U2.P21 63.37,24.61 62.62,25.36 62.62,36.76 62.55,36.83 61.92,36.83 v61.43,37.32
  Bottom 0.2: v53.12,48.87 56.62,48.87 57.12,49.37 69.11,49.37 70.11,48.37 IC1.12 | v13.12,49.37 15.12,51.37 37.33,51.37 38.12,52.15 38.12,53.1 38.52,53.5 39.15,53.5 39.94,52.71 IC8.12 | IC8.12 41.87,52.62 | U4.P13 55.62,37.62 56.62,36.62 60.87,36.62 60.87,36.75 v61.43,37.32 | IC8.12 44.81,52.71 44.83,52.68 46.02,52.68 46.99,53.66 49.15,53.66 51.69,56.2 v53.66,56.2 | U2.P21 63.5,23.49 66.36,20.64 IC3.16
D5  (via drill 0.35)
  Top 0.2: 41.87,57.87 IC8.14 40.32,59.37 39.05,59.37 38.42,58.74 38.42,56.75 v38.55,56.62 | v66.95,48.37 66.99,48.41 66.99,52.86 | 66.99,52.86 66.92,52.93 65.08,52.93 64.68,53.33 64.68,53.9 65.88,55.1 v65.88,57.37 | U2.P22 66.04,27.3 64.77,28.57 v64.77,35.56 | IC1.14 67.47,53.34 66.99,52.86
  Bottom 0.2: IC8.14 42.12,57.87 42.87,58.62 49.37,58.62 50.62,57.37 55.37,57.37 U11.P12 | 55.62,57.37 U11.P12 | U$1.P$28 7.62,55.12 8.62,56.12 18.11,56.12 18.86,56.87 33.12,56.87 33.37,56.62 v38.55,56.62 | 69.21,44.62 69.21,44.64 | v66.95,48.37 68.54,46.77 68.54,45.32 69.21,44.65 69.21,44.64 | U11.P12 61.48,57.47 61.49,57.46 65.79,57.46 v65.88,57.37 | IC3.17 63.82,19.68 65.32,18.18 69.94,18.18 70.72,18.96 70.72,21.68 69.85,22.54 67.94,22.54 U2.P22 | U4.P12 55.87,34.93 64.14,34.93 v64.77,35.56 65.82,36.62 69.86,36.62 72.36,39.12 72.36,41.49 69.21,44.64
D6  (via drill 0.35)
  Top 0.2: v58.87,27.55 58.87,29.36 58.1,30.13 58.1,31.11 56.52,32.7 U4.P11 | 55.62,32.62 U4.P11 | v51.37,54.87 v51.37,60.84 | v54.12,47.12 53.87,47.37 53.87,53.37 55.37,54.87 U11.P11 | 55.37,32.87 U4.P11 | U4.P11 54.93,32.7 53.34,34.29 53.34,38.73 51.75,40.32 v51.75,46.67
  Bottom 0.2: v58.87,27.55 58.87,26.11 61.29,26.11 | 61.29,26.11 66.86,26.11 68.36,24.61 U2.P23 | IC1.16 70.11,58.37 66.61,54.87 55.62,54.87 U11.P11 55.37,54.87 v51.37,54.87 | 42.12,62.87 IC8.16 42.51,63.46 46.08,63.46 46.32,63.22 46.32,62.15 46.88,61.58 49,61.58 49.01,61.59 49.85,61.59 50.61,60.84 v51.37,60.84 51.09,61.12 | 51.74,47.12 36.23,47.12 35.48,47.87 33.62,47.87 32.37,49.12 14.37,49.12 13.87,48.62 8.62,48.62 7.62,49.62 U$1.P$24 | IC3.18 61.28,26.1 61.29,26.11 | v51.75,46.67 51.75,47.1 51.74,47.12 | 51.74,47.12 v54.12,47.12
D7  (via drill 0.35)
  Top 0.2: 71.86,54.62 72.36,55.12 72.36,61.37 70.36,63.37 IC1.18 | v26.61,37.62 26.86,37.37 v26.86,36.12 | 71.86,54.62 72.86,53.62 72.86,42.62 74.86,40.62 74.86,32.13 v74.93,32.07 | 71.86,54.62 v71.61,54.37 | U2.P24 71.36,24.36 74.86,27.86 74.86,29.46 v74.93,29.53 | IC3.19 58.74,23.18 57.47,24.45 57.47,28.26 U4.P10
  Bottom 0.2: v71.61,54.37 57.37,54.37 55.62,52.62 U11.P10 | IC8.18 42.12,67.86 42.87,67.11 46.37,67.11 47.37,66.11 60.37,66.11 61.87,64.61 69.11,64.61 70.11,63.62 IC1.18 | U2.P24 71.11,24.36 71.12,24.36 71.12,18.73 70.17,17.78 59.37,17.78 58.74,18.41 IC3.19 | v26.61,37.62 20.61,37.62 19.81,38.42 10.79,38.42 9.21,40.01 9.21,42.55 7.46,44.29 U$1.P$20 | v26.86,36.12 27.86,35.12 34.12,35.12 37.62,31.61 51.37,31.61 52.87,30.11 55.37,30.11 U4.P10 | v74.93,32.07 v74.93,29.53
DOWN
  Top 0.2: 34.37,65.61 IC8.4 34.61,65.41 36.83,67.63 36.83,72.33 40.87,76.36 40.87,77.36 44.12,80.61 44.62,80.61 JOYSTICK1.3
  Bottom 0.2: RN1.12 50.12,76.61 47.37,79.36 46.12,79.36 44.87,80.61 JOYSTICK1.3
DOWN1
  Top 0.2: RN1.6 65.61,76.36 65.61,75.36 65.86,75.11 65.86,63.63 64.78,62.55 64.77,62.55 64.13,61.91 63.5,61.91 IC1.4
  Bottom 0.2: JOYSTICK2.3 75.82,80.81 74.58,79.57 68.46,79.57 RN1.6
GND
  pour Top: 0,0.32 130.18,0.32 130.18,92.71 0,92.71
IN*  (via drill 0.35)
  Top 0.2: v89.86,20 94.86,15 94.86,10.17 96.41,8.62 96.41,8.36 98.74,6.03 ATF22V10C.11 | v14.62,49.87 12.87,48.12 12.87,45.87 11.62,44.62 U$1.P$19 | v59.62,42.62 59.62,41.03 60.64,40.01 60.64,37.81 60.43,37.6 60.43,32.91 v60.48,32.87
  Bottom 0.2: v89.86,20 86.43,23.11 73.36,23.11 72.36,24.11 72.36,32.87 v60.48,32.87 | v14.62,49.87 32.37,49.87 33.12,49.12 35.62,49.12 37.12,47.62 51.47,47.62 51.8,47.94 55.88,47.94 57.47,46.36 57.47,44.77 v59.62,42.62
INT*
  Bottom 0.2: JP1.1 14.87,47.37 11.62,47.37 U$1.P$21
JOY1_IN_ENABLE_N  (via drill 0.35)
  Top 0.2: v89.86,9.87 89.86,11.12 88.61,12.37 ATF22V10C.18
  Bottom 0.2: v89.86,9.87 90.11,10.12 105.2,10.12 105.88,9.44 121.45,9.44 125.96,13.95 125.96,21.82 126.05,21.91 126.05,21.99 127.06,23 127.06,24.62 125.86,25.82 125.86,35.62 127.11,36.87 127.11,40.12 126.86,40.12 119.36,47.62 119.36,59.62 120.36,59.62 121.11,60.37 121.11,61.87 120.11,61.87 112.11,69.86 74.61,69.86 73.61,70.86 59.62,70.86 59.12,71.36 42.87,71.36 42.12,70.61 IC8.19 41.87,70.36 40.87,69.36 32.62,69.36 32.62,71.36 34.12,72.86 IC8.1
JOY1_IN_ENABLE_N1  (via drill 0.35)
  Top 0.2: v91.41,14.87 91.41,14.88 91.36,12.62 ATF22V10C.17
  Bottom 0.2: 73.11,67.86 71.36,66.11 70.36,66.11 IC1.19 | 73.11,67.86 74.11,68.86 106.06,68.86 112.36,62.56 112.36,60.37 113.36,59.37 113.36,59.36 114.11,58.61 114.11,44.37 121.86,36.62 123.36,36.62 123.36,24.86 123.13,24.62 123.13,23 123.36,22.77 123.36,11.92 121.28,9.84 106.05,9.84 100.96,14.92 92.42,14.92 v91.41,14.87 | 73.11,67.86 71.36,69.61 63.62,69.61 62.62,68.61 IC1.1
LEFT  (via drill 0.35)
  Top 0.2: v52.12,65.36 52.37,65.61 52.37,75.11 52.62,75.36 52.62,76.36 RN1.11
  Bottom 0.2: v52.12,65.36 50.62,63.87 37.87,63.87 34.37,60.37 IC8.6 | JOYSTICK1.4 47.62,80.61 49.87,78.36 50.87,78.36 52.62,76.61 RN1.11
LEFT1
  Top 0.2: 62.62,56.12 IC1.6 62.58,55.91 62.58,55.98 66.99,60.4 66.99,73.98 67.94,74.93 RN1.5 | 67.86,76.36 RN1.5 | JOYSTICK2.4 79.54,80.81 77.47,78.74 70.17,78.74 RN1.5
N$1
  Top 0.2: J4.SWITCH J4.PIN 121.39,48.47 R5.2
N$2
  Top 1.016: U$2.3 99.38,79.06 97.47,77.15 S1.2
N$3  (via drill 0.35)
  Top 0.2: v23.36,32.43 23.36,48.12 20.11,48.12 19.36,47.37 17.61,47.37 JP1.2 | v66.61,32.12 73.86,39.37 73.86,39.62 U2.P16
  Bottom 0.2: v66.61,32.12 63.62,29.11 40.12,29.11 38.87,30.36 25.11,30.36 23.36,32.12 v23.36,32.43
N$4
  Top 0.2: J3.PIN J3.SWITCH 118.43,44.45 R8.2
N$5  (via drill 0.35)
  Top 0.2: v54.12,14.87 54.12,19.61 53.87,19.86 IC3.21 | 75.86,4.87 ATF22V10C.2 75.88,5.26 71.12,10.02 v71.12,12.38 | v25.86,28.11 25.86,67.61 29.36,71.11 IC4.18
  Bottom 0.2: v54.12,14.87 55.87,13.12 70.39,13.12 v71.12,12.38 | v25.86,28.11 26.11,27.86 44.87,27.86 50.87,21.86 51.87,21.86 53.62,20.11 IC3.21
N$6  (via drill 0.35)
  Top 0.2: v24.11,28.11 24.11,53.87 22.11,55.87 IC4.9 | v88.36,7.37 88.36,4.87 ATF22V10C.7 | 40.87,18.86 40.87,19.86 IC3.26 40.96,14.02 v41,13.98
  Bottom 0.2: v24.11,28.11 26.86,25.36 35.62,25.36 40.87,20.11 IC3.26 | v41,13.98 43.37,11.62 53.87,11.62 56.93,8.55 84.15,8.55 85.33,7.37 v88.36,7.37
N$7  (via drill 0.35)
  Top 0.2: v48.87,15.62 48.87,19.61 48.62,19.86 IC3.23 48.58,21.59 45.09,25.08 45.09,31.43 v44.13,32.39 | 78.36,4.87 ATF22V10C.3 73.66,9.53 73.39,9.53 v72.82,10.1 | IC4.16 26.67,63.18 v26.67,39.69
  Bottom 0.2: v48.87,15.62 51.87,12.62 69.21,12.62 | 69.36,12.62 69.21,12.62 | v44.13,32.39 43.81,32.71 37.45,32.71 30.14,40.02 27.83,40.02 27.82,40.01 26.99,40.01 v26.67,39.69 | 69.21,12.62 69.3,12.62 71.44,10.48 72.43,10.48 v72.82,10.1
N$8  (via drill 0.35)
  Top 0.2: v81.36,7.87 83.36,5.87 83.36,4.87 ATF22V10C.5 | 46.12,19.86 IC3.24 46.04,19.37 47.62,17.78 47.62,11.09 v47.84,10.87 | IC4.14 29.61,60.87 32.12,58.37 32.12,48.87 34.37,46.62 34.37,40.25 v34.61,40.01 | v32.39,40.01 32.39,29.09 32.46,29.02 v32.46,26.8
  Bottom 0.2: v47.84,10.87 53.87,10.87 56.87,7.87 v81.36,7.87 | IC3.24 45.87,20.11 40.12,25.86 35.62,25.86 34.68,26.8 v32.46,26.8 | v32.39,40.01 v34.61,40.01
N$9  (via drill 0.35)
  Top 0.2: v43.62,9.87 43.62,19.86 IC3.25 43.37,20.11 43.37,28.61 38.62,33.37 38.62,50.62 v37.12,52.12 | v84.36,7.37 85.86,5.87 85.86,4.87 ATF22V10C.6
  Bottom 0.2: v43.62,9.87 43.87,9.62 51.41,9.62 53.91,7.12 84.11,7.12 v84.36,7.37 | v37.12,52.12 35.37,53.87 31.61,53.87 29.61,55.87 IC4.12
N$10  (via drill 0.35)
  Top 0.2: IC3.1 36.12,4.87 36.12,5.87 36.87,6.62 36.84,6.64 36.84,37.83 35.88,38.79 35.88,42.98 37.07,44.18 37.12,44.18 37.15,44.21 v37.15,49.21 | v37,60.97 37.15,60.83 37.15,60.01 36.51,59.37 36.51,52.48 36.43,52.4 36.43,50.88 36.51,50.8 v36.51,50.48
  Bottom 0.2: IC3.1 36.12,4.87 37.87,6.62 89.36,6.62 91.11,4.87 ATF22V10C.8 | IC4.7 22.11,61.12 27.61,61.12 28.61,62.12 31.36,62.12 32.67,60.81 32.67,59.93 33.23,59.36 36.5,59.36 37.15,60.01 37.15,60.83 v37,60.97 | v36.51,50.48 36.51,49.85 v37.15,49.21
N$12  (via drill 0.35)
  Top 0.2: v24.86,5.9 24.86,63.12 22.11,65.86 IC4.5
  Bottom 0.2: 38.39,3.12 92.11,3.12 93.61,4.62 ATF22V10C.9 | 38.39,3.12 33.78,3.12 31.03,5.87 24.86,5.87 v24.86,5.9 | IC3.2 38.42,3.14 38.39,3.12
N$13
  Top 0.2: IC5.2 21.11,44.12 11.62,34.62 U$1.P$11
N$14  (via drill 0.35)
  Top 0.2: U2.P14 78.74,39.05 77.47,37.78 77.47,33.34 v77.79,33.02 | ATF22V10C.22 78.42,23.19 77.62,23.98 77.62,27.47 v77.47,27.62
  Bottom 0.2: v77.79,33.02 77.79,27.94 v77.47,27.62
N$15  (via drill 0.35)
  Top 0.2: U2.P15 76.36,39.87 76.36,41.37 78.86,41.37 79.86,40.37 79.86,31.29 v79.69,31.11 | ATF22V10C.21 80.96,23.19 80.16,23.98 80.16,27.79 v80.01,27.94
  Bottom 0.2: v79.69,31.11 80.01,30.8 v80.01,27.94
N$16
  Top 0.2: 110.17,19.05 Q1.2 109.22,21.59 U2.P39 | 110.17,19.05 C3.2 | C2.1 107.59,16.47 110.17,19.05
N$17
  Top 0.2: J2.SWITCH J2.PIN
  Bottom 0.2: U2.P35 99.11,24.61 101.86,27.36 121.36,27.36 J2.SWITCH
N$18
  Top 0.2: U1.5 83.83,57.47 84.94,56.35 94.46,56.35 U3.5
  Bottom 0.2: U3.5 95.61,55.12 96.61,54.12 103.36,54.12 103.86,53.62 103.86,53.61 109.61,47.86 109.61,41.83 U2.P1
N$19
  Bottom 0.2: IC5.4 21.11,39.12 20.11,40.12 13.62,40.12 11.62,42.12 U$1.P$17
N$20
  Top 0.2: 118.43,81.91 R7.2 119.38,81.91 D1.A
N$21
  Top 0.2: U1.16 94.31,62.55 95.1,61.75 101.76,61.75 U3.16 103.36,60.12 103.36,59.87 105.86,57.37 105.86,45.12 107.36,43.62 107.36,41.62 109.11,39.87 U2.P2
N$22
  Bottom 0.2: IC4.17 29.36,68.61 28.36,69.61 13.62,69.61 11.87,71.36 6.87,71.36 6.12,70.61 6.12,68.86 7.87,68.86 8.62,68.11 8.62,65.11 7.62,65.11 U$1.P$36
N$23  (via drill 0.35)
  Top 0.2: v13.37,26.11 13.37,28.92 14.92,30.48 14.92,32.92 v15.62,33.62
  Bottom 0.2: v15.62,33.62 20.86,33.62 21.11,33.87 IC5.6 | v13.37,26.11 12.87,25.61 8.62,25.61 7.62,24.61 U$1.P$4
N$24
  Top 0.2: J5.SWITCH J5.PIN 121.39,61.8 R1.2
N$25
  Bottom 0.2: IC5.8 21.11,29.11 18.36,31.86 11.62,31.86 U$1.P$9
N$26
  Bottom 0.2: IC5.11 28.86,23.86 27.86,24.86 15.87,24.86 13.87,26.86 11.62,26.86 U$1.P$5
N$27
  Bottom 0.2: IC5.13 28.86,28.86 23.36,28.86 22.36,27.86 15.22,27.86 14.72,28.36 8.87,28.36 7.62,27.11 U$1.P$6
N$28
  Bottom 0.2: U$1.P$10 7.62,32.12 8.87,33.37 11.87,33.37 11.91,33.32 13.68,33.32 14.06,32.93 22.57,32.93 23.61,33.97 IC5.15
N$29  (via drill 0.35)
  Top 0.2: U$1.P$7 11.62,29.36 12.87,30.61 12.87,33.77 v13.98,34.89
  Bottom 0.2: 16.11,35.12 16.19,35.12 | 16.19,35.12 22.11,35.12 23.86,36.87 26.86,36.87 28.86,38.87 IC5.17 | 16.19,35.12 14.21,35.12 v13.98,34.89
N$30  (via drill 0.35)
  Top 0.2: v39.37,11.75 39.62,11.99 39.62,30.98 37.78,32.81 37.78,39.05 37.3,39.54 v37.3,39.87 | 39.62,9.6 v39.37,9.84 42.23,6.99 42.55,6.99 43.5,6.03 IC3.4
  Bottom 0.2: 36.08,41.37 29.11,41.37 IC5.18 | 36.08,41.37 36.12,41.37 | v39.37,11.75 v39.37,9.84 | v37.3,39.87 37.3,40.15 36.08,41.37
N$31  (via drill 0.35)
  Top 0.2: v45.87,17.11 45.87,4.87 IC3.5 | IC5.16 29.11,36.37 29.11,36.12 31.11,34.12 v31.11,24.45 | v33.87,18.73 33.66,18.94 33.66,20.95 33.02,20.95 v31.11,22.86
  Bottom 0.2: v45.87,17.11 45.12,17.86 34.73,17.86 v33.87,18.73 | v31.11,24.45 v31.11,22.86
N$32  (via drill 0.35)
  Top 0.2: v40.37,29.86 42.12,28.11 42.12,10.37 42.23,10.25 42.23,9.21 44.46,6.97 44.46,3.7 44.45,3.69 44.45,3.49 45.4,2.54 47.94,2.54 48.58,3.17 IC3.6
  Bottom 0.2: v40.37,29.86 39.12,31.11 29.36,31.11 29.11,31.36 IC5.14
N$33  (via drill 0.35)
  Top 0.2: v26.86,18.86 26.86,26.11 28.86,26.11 IC5.12 | v50.62,12.87 50.62,6.12 51.12,5.62 51.12,4.87 IC3.7
  Bottom 0.2: v26.86,18.86 27.11,18.61 29.86,18.61 32.62,15.87 47.62,15.87 v50.62,12.87
N$34  (via drill 0.35)
  Top 0.2: v23.36,15.62 23.36,26.11 21.36,26.11 IC5.9 | v52.87,10.12 53.12,9.87 53.12,6.12 53.62,5.62 53.62,4.87 IC3.8
  Bottom 0.2: v23.36,15.62 25.61,13.37 40.62,13.37 43.37,10.62 44.24,10.62 44.74,10.12 v52.87,10.12
N$35  (via drill 0.35)
  Top 0.2: IC3.9 56.37,4.87 56.37,5.87 57.37,6.87 57.37,22 v57.05,22.32
  Bottom 0.2: 56.37,22.36 56.2,22.36 | 56.2,22.36 51.12,22.36 45.12,28.36 34.62,28.36 33.12,29.86 22.86,29.86 21.36,31.36 IC5.7 | 56.2,22.36 57,22.36 v57.05,22.32
N$36  (via drill 0.35)
  Top 0.2: v57.37,2.37 58.62,3.62 58.62,4.62 IC3.10 | v16.36,19.11 16.36,32.24 18.1,33.97 18.1,35.6 v18.36,35.87
  Bottom 0.2: v18.36,35.87 20.61,35.87 21.11,36.37 IC5.5 | 18.36,13.75 18.36,1.61 56.62,1.61 v57.37,2.37 | 18.36,13.75 18.36,13.87 | v16.36,19.11 16.36,17.29 18.41,15.24 18.41,13.8 18.36,13.75
N$37
  Bottom 0.2: IC6.1 21.11,20.11 19.36,21.86 11.62,21.86 U$1.P$1
N$38
  Top 0.2: IC6.4 21.11,12.62 19.11,14.62 19.11,39.62 21.11,41.62 IC5.3
N$39
  Bottom 0.2: IC6.5 21.11,9.87 20.11,10.87 19.36,10.87 18.86,11.37 18.86,12.52 IC6.3
N$40  (via drill 0.35)
  Top 0.2: 56.37,19.86 IC3.20 56.2,9.84 54.62,8.27 54.62,3.7 53.87,2.95 v53.87,2.37
  Bottom 0.2: v53.87,2.37 26.11,2.37 21.36,7.12 IC6.6
N$41
  Top 0.2: 28.86,15.12 26.86,13.12 26.86,6.87 28.86,4.87 IC6.8 | 28.86,15.12 28.86,17.36 IC6.13 | 28.86,15.12 IC6.12
N$42
  Bottom 0.2: IC3.27 38.37,20.11 36.26,22.22 33.66,22.22 33.34,21.91 30.16,21.91 29.7,22.36 14.7,22.36 13.95,23.11 7.12,23.11 6.12,24.11 6.12,35.01 6.99,35.88 10.1,35.88 10.12,35.87 11.37,37.12 U$1.P$13
N$43  (via drill 0.35)
  Top 0.2: v51.37,34.62 51.37,20.11 IC3.22
  Bottom 0.2: v51.37,34.62 51.37,37.68 50.29,38.75 46.88,38.75 46.87,38.73 46.04,38.73 45.66,39.12 31.93,39.12 30.43,40.62 14.87,40.62 11.87,43.62 11.12,43.62 10.12,42.62 10.12,41 U$1.P$15
N$64
  Bottom 0.2: R5.1 126.36,48.17 126.03,48.51 126.03,51.82 127.06,52.84 127.06,55.98 126.03,57.01 126.03,65.79 127.06,66.81 127.06,69.95 126.03,70.98 126.03,76.5 C27.-
N$94
  Bottom 0.2: R1.1 119.86,60.87 113.86,60.87 C1.-
N$99  (via drill 0.35)
  Top 0.2: IC8.13 42.12,55.37 43.87,57.12 43.87,58.87 42.62,60.12 42.12,60.12 IC8.15 41.87,60.12 39.87,62.12 39.87,63.37 41.87,65.36 IC8.17 | RN1.8 60.33,65.72 60.92,65.12 60.92,60.56 61.49,60 63.61,60 64.57,60.96 v65.09,60.96
  Bottom 0.2: RN1.8 60.12,76.61 57.37,79.36 55.62,79.36 49.87,85.11 39.37,85.11 31.61,77.36 28.61,77.36 27.86,76.61 27.86,72.11 30.61,72.11 32.12,70.61 32.12,66.61 40.37,66.61 41.37,65.61 41.87,65.61 IC8.17 | 70.28,50.84 70.36,50.87 | 70.28,50.84 IC1.13 | v65.09,60.96 IC1.17 70.36,60.87 71.86,59.37 71.86,56.12 71.63,55.88 | IC1.15 71.63,55.88 | 71.63,55.88 71.75,55.88 72.71,54.93 72.71,53.27 70.28,50.84
OUT*  (via drill 0.35)
  Top 0.2: v70.86,14.12 v72.36,15.62 | v9.12,22.11 9.12,32.62 7.62,34.12 7.62,34.37 U$1.P$12
  Bottom 0.2: v72.36,15.62 72.61,15.37 83.86,15.37 85.11,14.12 99.61,14.12 101.11,12.62 ATF22V10C.13 | v70.86,14.12 69.11,15.87 49.62,15.87 49.12,16.36 34.87,16.36 32.37,18.86 32.12,18.86 29.86,21.11 24.61,21.11 22.36,18.86 19.32,18.86 17.57,20.61 10.62,20.61 v9.12,22.11
RIGHT  (via drill 0.35)
  Top 0.2: JOYSTICK1.5 50.12,80.61 49.37,80.61 44.13,75.38 44.13,60.64 44.45,60.33 v44.45,55.25
  Bottom 0.2: IC8.8 34.37,55.37 34.62,55.62 40.12,55.62 41.12,56.62 43.4,56.62 43.4,56.3 v44.45,55.25 | RN1.10 55.12,76.61 51.12,80.61 50.37,80.61 JOYSTICK1.5
RIGHT1  (via drill 0.35)
  Top 0.2: v65.36,53.62 68.11,56.37 68.11,73.11 70.36,75.36 70.36,76.36 RN1.4
  Bottom 0.2: v65.36,53.62 62.62,50.87 IC1.8 | JOYSTICK2.5 82.08,80.81 80.01,78.74 72.71,78.74 RN1.4
SN76489-CLOCK  (via drill 0.35)
  Top 0.2: U11.P14 55.62,62.37 56.12,62.37 57.62,60.87 57.62,51.92 59.69,49.85 59.69,49.53 60.01,49.21 60.01,45.09 58.1,43.18 58.1,40.35 v58.05,40.3 | v102.61,28.61 106.61,24.61 U2.P38 | v93.95,30.86 93.2,31.61 88.36,31.61 v88.36,30.86 | v58.05,40.3 57.79,40.04 57.79,33.81 v58.3,33.3 | U4.P14 58.02,40.32 v58.05,40.3
  Bottom 0.2: v102.61,28.61 100.36,30.86 v93.95,30.86 | v88.36,30.86 85.61,33.62 78.16,33.62 78.07,33.7 58.7,33.7 v58.3,33.3
SND1_ENABLE_N  (via drill 0.35)
  Top 0.2: v45.12,53.37 45.46,53.02 45.46,42.2 46.32,41.34 46.32,39.92 47.13,39.12 51.69,39.12 52.12,38.69 52.12,17.32 v52.09,17.3
  Bottom 0.2: v45.12,53.37 46.62,54.87 47.87,54.87 | ATF22V10C.20 83.36,12.62 81.61,14.37 71.61,14.37 69.61,16.36 53.03,16.36 v52.09,17.3 | 47.87,54.87 U11.P6 | U11.P5 47.94,54.94 47.87,54.87
SND1_READY  (via drill 0.35)
  Top 0.2: v39.69,37.15 R2.2 40.01,41.27 40.01,44.45 44.13,48.58 44.13,53.67 45.08,54.61 45.4,54.93 v45.4,62.55 | IC6.9 31.43,7.3 34.55,10.42 34.55,18.99 34.61,19.05 34.61,36.55 35.2,37.15 v35.24,37.15
  Bottom 0.2: U11.P4 46.77,61.18 46.72,61.18 45.91,61.98 45.91,62.04 v45.4,62.55 | v35.24,37.15 v39.69,37.15
SND2_ENABLE_N  (via drill 0.35)
  Top 0.2: U4.P6 48.12,32.87 48.12,35.12 U4.P5 | v54.91,17.61 54.91,18.57 54.87,18.61 54.87,23.56 v54.61,23.81 | v54.61,25.72 53.12,27.21 v53.12,30.86
  Bottom 0.2: v53.12,30.86 51.37,32.62 48.12,32.62 U4.P6 | ATF22V10C.19 85.86,12.62 83.61,14.87 71.86,14.87 69.86,16.86 55.66,16.86 v54.91,17.61 | v54.61,25.72 v54.61,23.81
SND2_READY  (via drill 0.35)
  Top 0.2: U4.P4 48.12,37.62 48.62,37.62 50.62,35.62 50.62,22.04 50.15,21.58 50.15,18.94 50.16,18.93 50.16,14.92 49.85,14.61 49.77,14.53 49.21,13.97 49.21,10.04 49.23,10.02 48.12,8.9 v48.12,8.87
  Bottom 0.2: v48.12,8.87 29.86,8.87 29.11,9.62 IC6.10 | R6.2 45.12,37.87 47.87,37.87 U4.P4
SNDOUT1  (via drill 0.35)
  Top 0.2: v38.8,52.82 38.8,53.28 37.47,54.61 37.47,59.05 38.1,59.69 38.1,70.1 v38.12,70.11
  Bottom 0.2: U11.P7 47.87,52.37 47.12,51.62 40.33,51.62 40.15,51.8 39.82,51.8 v38.8,52.82 | C27.+ 124.36,77.36 123.36,76.36 116.61,76.36 116.11,76.86 92.86,76.86 90.36,74.36 41.12,74.36 38.12,71.36 v38.12,70.11
SNDOUT2  (via drill 0.35)
  Top 0.2: v49.87,28.36 48.12,30.11 U4.P7 | v71.57,35.18 v68.18,31.8
  Bottom 0.2: v49.87,28.37 v49.87,28.36 | v49.87,28.37 50.12,28.61 | v71.57,35.18 74.86,38.48 74.86,46.37 76.61,48.12 76.61,63.87 94.86,63.87 95.11,64.11 107.86,64.11 111.11,60.87 C1.+ | v68.18,31.8 67.26,31.8 64.17,28.71 50.21,28.71 v49.87,28.37
SYSRESET*
  Bottom 0.2: ATF22V10C.14 98.61,12.37 96.86,10.62 89.35,10.62 86.99,8.26 85.01,8.26 84.31,8.95 57.28,8.95 54.12,12.12 43.87,12.12 40.62,15.37 30.61,15.37 29.61,16.36 20.11,16.36 16.36,20.11 9.37,20.11 7.62,21.86 U$1.P$2
TMS9118_RW(*)_TMS4416_W(*)
  Top 0.2: U1.4 83.83,60.01 84.94,58.89 94.46,58.89 U3.4
  Bottom 0.2: U3.4 95.36,57.87 94.61,58.62 84.11,58.62 84.11,46.87 84.86,46.12 85.33,46.12 86.36,45.09 U2.P11
TMS9918_AD0-TMS4416_A7
  Bottom 0.2: 88.86,43.87 88.86,39.87 U2.P10 | 88.86,43.87 96.11,43.87 96.61,44.37 102.61,44.37 103.11,44.87 U3.10 | U1.10 85.42,47.31 88.86,43.87
TMS9918_AD1-TMS4416_A6  (via drill 0.35)
  Top 0.2: U1.6 83.83,54.93 84.94,53.81 85.87,53.81 86.03,53.98 90.17,53.98 v91.44,52.71 | v98.36,43.37 98.11,43.62 98.11,49.87 95.61,52.37 95.61,52.62 U3.6 v93.98,52.71
  Bottom 0.2: v98.36,43.37 95.11,43.37 91.61,39.87 U2.P9 | v91.44,52.71 v93.98,52.71
TMS9918_AD2-TMS4416_A5  (via drill 0.35)
  Top 0.2: U1.7 83.83,52.39 84.94,51.27 86.21,51.27 86.99,50.48 v89.53,50.48 | v97.11,42.62 97.61,43.12 97.61,47.87 95.61,49.87 95.61,50.12 U3.7 94.3,50.16 v93.98,50.48
  Bottom 0.2: v97.11,42.62 96.86,42.62 94.11,39.87 U2.P8 | v89.53,50.48 v93.98,50.48
TMS9918_AD3-TMS4416_A4
  Top 0.2: U1.8 83.83,49.85 84.94,48.73 94.46,48.73 U3.8 95.61,47.62 95.61,47.37 97.11,45.87 97.11,44.37 96.36,43.62 96.36,39.87 U2.P7
TMS9918_AD4-TMS4416_A3  (via drill 0.35)
  Top 0.2: v99.11,46.12 99.11,39.87 U2.P6
  Bottom 0.2: 99.11,48.87 102.11,48.87 103.11,47.87 U3.11 | 99.11,48.87 86.36,48.87 85.61,49.62 U1.11 | 99.11,48.87 v99.11,46.12
TMS9918_AD5-TMS4416_A2
  Top 0.2: U2.P5 101.61,39.87 101.61,48.37 103.11,49.87 103.11,50.12 U3.12
  Bottom 0.2: U1.12 85.61,52.37 86.61,51.37 102.11,51.37 103.11,50.37 U3.12
TMS9918_AD6-TMS4416_A1
  Top 0.2: U2.P4 104.36,39.87 104.86,40.37 104.86,50.87 103.36,52.37 103.36,52.62 U3.13
  Bottom 0.2: U1.13 85.61,54.87 86.61,53.87 96.11,53.87 97.11,52.87 103.11,52.87 U3.13
TMS9918_AD7-TMS4416_A0
  Top 0.2: U3.14 103.36,55.37 105.36,53.37 105.36,44.5 106.05,43.82 106.05,40.32 U2.P3
  Bottom 0.2: U1.14 85.61,57.37 86.61,56.37 102.11,56.37 103.11,55.37 U3.14
TRIGGER  (via drill 0.35)
  Top 0.2: RN1.9 57.62,76.36 57.62,75.36 52.87,70.61 52.87,54.82 52.71,54.66 52.71,52.39 51.48,51.16 v51.48,50.89
  Bottom 0.2: JOYSTICK1.9 49.12,83.61 50.62,82.11 52.12,82.11 57.62,76.61 RN1.9 | IC8.11 41.79,50.16 42.44,50.81 51.4,50.81 v51.48,50.89
TRIGGER1  (via drill 0.35)
  Top 0.2: IC1.11 70.17,46.24 71.79,47.86 71.79,49.57 v72.07,49.85 | v75.25,67.31 75.25,74.3 RN1.3
  Bottom 0.2: JOYSTICK2.9 82.08,83.65 83.82,81.91 83.82,78.42 80.26,78.42 80.18,78.34 74.84,78.34 RN1.3 | v72.07,49.85 72.07,50.48 74.3,52.71 74.3,66.36 v75.25,67.31
UP
  Bottom 0.2: 46.87,75.86 47.12,75.86 47.62,76.36 RN1.13 | 46.87,75.86 39.62,75.86 34.37,70.61 IC8.2 | 46.87,75.86 42.12,80.61 JOYSTICK1.2
UP1
  Top 0.2: RN1.7 62.87,75.36 64.61,73.61 64.61,68.11 62.62,66.11 IC1.2
  Bottom 0.2: JOYSTICK2.2 73.6,80.81 72.36,82.06 68.4,82.06 RN1.7
VCC  (via drill 0.35)
  Top 0.2: C15.1 75.86,47.31 | 75.86,47.31 U1.9 82.87,47.31 84.77,45.4 92.39,45.4 C21.1 U3.9 95.36,44.87 95.36,25.86 94.11,24.61 U2.P33 C16.1 | C17.1 U4.P16 | IC3.28 C7.1 | C12.1 IC6.14 | C6.1 27.62,78.1 IC4.20 | C13.1 IC8.20 | C20.1 U11.P16 | C14.1 73.34,71.75 IC1.20 70.36,68.86 75.86,63.37 75.86,47.31 | REG1.P$3 114.62,82.87 R7.1 115.57,79.06 C4.+ | ATF22V10C.24 C8.1 | IC5.20 C10.1 | 43.37,41.07 v43.37,44.62 | 43.37,41.07 43.37,38.62 42.62,37.87 R6.1 | 35.87,23.61 C7.1 | v77.86,73.61 77.86,76.36 RN1.1 | R2.1 43.25,40.96 43.37,41.07 | C7.1 35.88,35.29 v35.8,35.37
  Bottom 0.2: 42.62,35.39 42.62,37.62 R6.1 | 42.62,35.39 42.62,34.37 R9.2 | 54.62,45.62 55.37,45.62 U4.P16 50.16,45.4 49.21,46.36 49.01,46.36 49,46.37 43.4,46.37 43.37,46.4 | 43.37,46.4 43.37,46.51 43.2,46.67 C10.1 | 43.37,46.4 v43.37,44.62 | IC6.2 21.36,17.61 22.11,18.36 25.36,18.36 26.86,19.86 28.86,19.86 IC6.14 | C12.1 32.62,20.11 35.87,20.11 IC3.28 36.12,19.86 37.62,18.36 55.8,18.36 56.8,17.36 73.34,17.36 | C16.1 93.86,22.11 89.36,17.61 73.73,17.61 73.48,17.36 73.34,17.36 | RN1.1 78.11,76.61 78.86,77.36 117.11,77.36 C4.+ | Q2.C 108.36,46.12 108.11,46.37 100.36,46.37 99.11,45.12 95.61,45.12 U3.9 | C20.1 58.87,67.61 69.36,67.61 70.11,68.36 IC1.20 | C13.1 41.87,76.86 40.87,77.86 32.87,77.86 31.36,76.36 29.61,76.36 IC4.20 | IC8.20 42.12,72.86 72.36,72.86 73.11,72.11 C14.1 73.36,72.11 76.36,72.11 v77.86,73.61 | v35.8,35.37 42.59,35.37 42.62,35.39 | C8.1 73.34,17.36 | 73.34,17.36
VDP-RD0  (via drill 0.35)
  Top 0.2: v94.11,27.11 91.61,24.61 U2.P32 | v79.11,61.87 79.36,62.12 79.36,63.37 77.86,64.86 U1.2
  Bottom 0.2: v94.11,27.11 86.61,34.62 76.11,34.62 75.56,35.16 75.56,37.15 76.61,38.2 76.61,38.37 77.61,39.37 77.61,46.12 78.36,46.12 79.11,46.87 v79.11,61.87
VDP-RD1  (via drill 0.35)
  Top 0.2: v82.36,46.37 87.61,41.12 87.61,25.86 88.86,24.61 U2.P31
  Bottom 0.2: v82.36,46.37 82.36,62.62 77.86,62.62 U1.3
VDP-RD2  (via drill 0.35)
  Top 0.2: v86.11,37.87 86.11,24.61 U2.P30
  Bottom 0.2: U1.15 85.36,59.87 83.61,59.87 83.61,46.62 84.61,45.62 84.61,41.75 85.09,41.27 85.09,38.89 v86.11,37.87
VDP-RD3  (via drill 0.35)
  Top 0.2: 76.85,45.87 v74.11,45.87 | 76.85,45.87 76.86,45.87 | U2.P29 83.61,24.61 83.11,25.11 83.11,37.54 82.23,38.42 82.23,39.06 82.4,39.23 82.4,40.32 76.85,45.87
  Bottom 0.2: v74.11,45.87 73.11,46.87 73.11,47.87 73.36,47.87 74.36,48.87 74.86,48.87 76.11,50.12 76.11,64.77 76.11,64.86 76.11,65.21 77.27,66.36 84.11,66.36 85.36,65.11 U1.17
VDP-RD4  (via drill 0.35)
  Top 0.2: v81.11,35.37 81.11,24.61 U2.P28 | v106.61,54.37 v106.61,45.62
  Bottom 0.2: v81.11,35.37 82.36,36.62 100.11,36.62 102.86,39.37 102.86,41.83 104.86,43.83 104.86,43.87 v106.61,45.62 | v106.61,54.37 106.61,56.6 104.1,59.12 99.36,59.12 95.61,62.87 U3.2
VDP-RD5  (via drill 0.35)
  Top 0.2: v78.86,36.91 78.86,32.19 v78.74,32.07 | U2.P27 v78.74,28.89
  Bottom 0.2: U3.3 95.36,60.37 94.36,61.37 83.11,61.37 83.11,46.12 82.61,45.62 80.11,45.62 80.11,38.16 v78.86,36.91 | v78.74,32.07 v78.74,28.89
VDP-RD6  (via drill 0.35)
  Top 0.2: v100.36,43.62 101.11,44.37 101.11,55.37 103.11,57.37 103.11,57.62 U3.15 | v76.36,35.37 76.36,32.22 v76.52,32.07 | U2.P26 76.2,29.21 v76.52,29.53
  Bottom 0.2: v100.36,43.62 100.36,39.37 98.11,37.12 98.08,37.15 80.96,37.15 79.18,35.37 v76.36,35.37 | v76.52,32.07 v76.52,29.53
VDP-RD7  (via drill 0.35)
  Top 0.2: v91.36,30.86 v89.86,29.36
  Bottom 0.2: v91.36,30.86 96.61,36.12 109.86,36.12 113.11,39.37 113.11,43.15 111.9,44.37 111.86,44.37 111.36,44.87 110.86,44.87 110.11,45.62 110.11,56.67 103.92,62.87 U3.17 103.36,62.87 | 73.86,24.61 U2.P25 75.25,26.04 86.68,26.04 88.51,27.87 88.51,28.01 | 88.44,27.94 88.51,28.01 | 88.51,28.01 v89.86,29.36
VDP_MODE
  Top 0.2: ATF22V10C.16 93.61,12.62 93.61,14.62 85.36,22.86 82.61,22.86 82.61,37.37 81.36,38.62 81.36,39.62 U2.P13
VID_RESET*
  Top 0.2: ATF22V10C.15 96.36,12.62 96.61,12.87 96.61,24.36 U2.P34
  Bottom 0.2: R9.1 40.12,34.12 41.12,33.12 46.12,33.12 46.87,33.87 56.91,33.87 57.41,34.37 65.11,34.37 65.36,34.12 86.11,34.12 95.61,24.61 96.36,24.61 U2.P34
VOLTAGE-IN
  Top 1.016: S1.1 103.63,73.34 C5.+ REG1.P$1
WAIT*  (via drill 0.35)
  Top 0.2: v17.61,13.62 v19.61,11.62
  Bottom 0.2: v19.61,11.62 19.86,11.37 22.36,11.37 23.36,12.37 28.86,12.37 IC6.11 | v17.61,13.62 11.62,19.61 8.12,19.61 5.62,22.11 5.62,61.37 10.37,61.37 11.37,62.37 U$1.P$33
XTAL1
  Top 0.2: U2.P40 111.76,24.13 Q1.1 115.25,20.32 C9.2

### Text on the board
tNames: +9V IN | 100uf | 4.7k | 10uf | 10uf | AUD 1 | 150k | AUD 2 | 10uf | 74LS244 | Lum | 74LS244 | SN76489 | TMS4416 | 74LS244 | TMS4416 | 400 | 150k | 2N2222 | 2k | 2k | 75 | VID OUT | TMS9918 VDP | 4.7k | SN76489 | 74LS244 | VID IN | ~10.7mhz | 470 | 33pf | 33pf | 62256 SRAM | 0-60pf | DECODER | 74LS00 | TRS-80 Model 1 / Game Card-V2.0 / Joe Rounceville
tValues: VIN | VCC